# Altium project ANTS-MotherBoard-B1.PrjPcb (part 1 of 2)
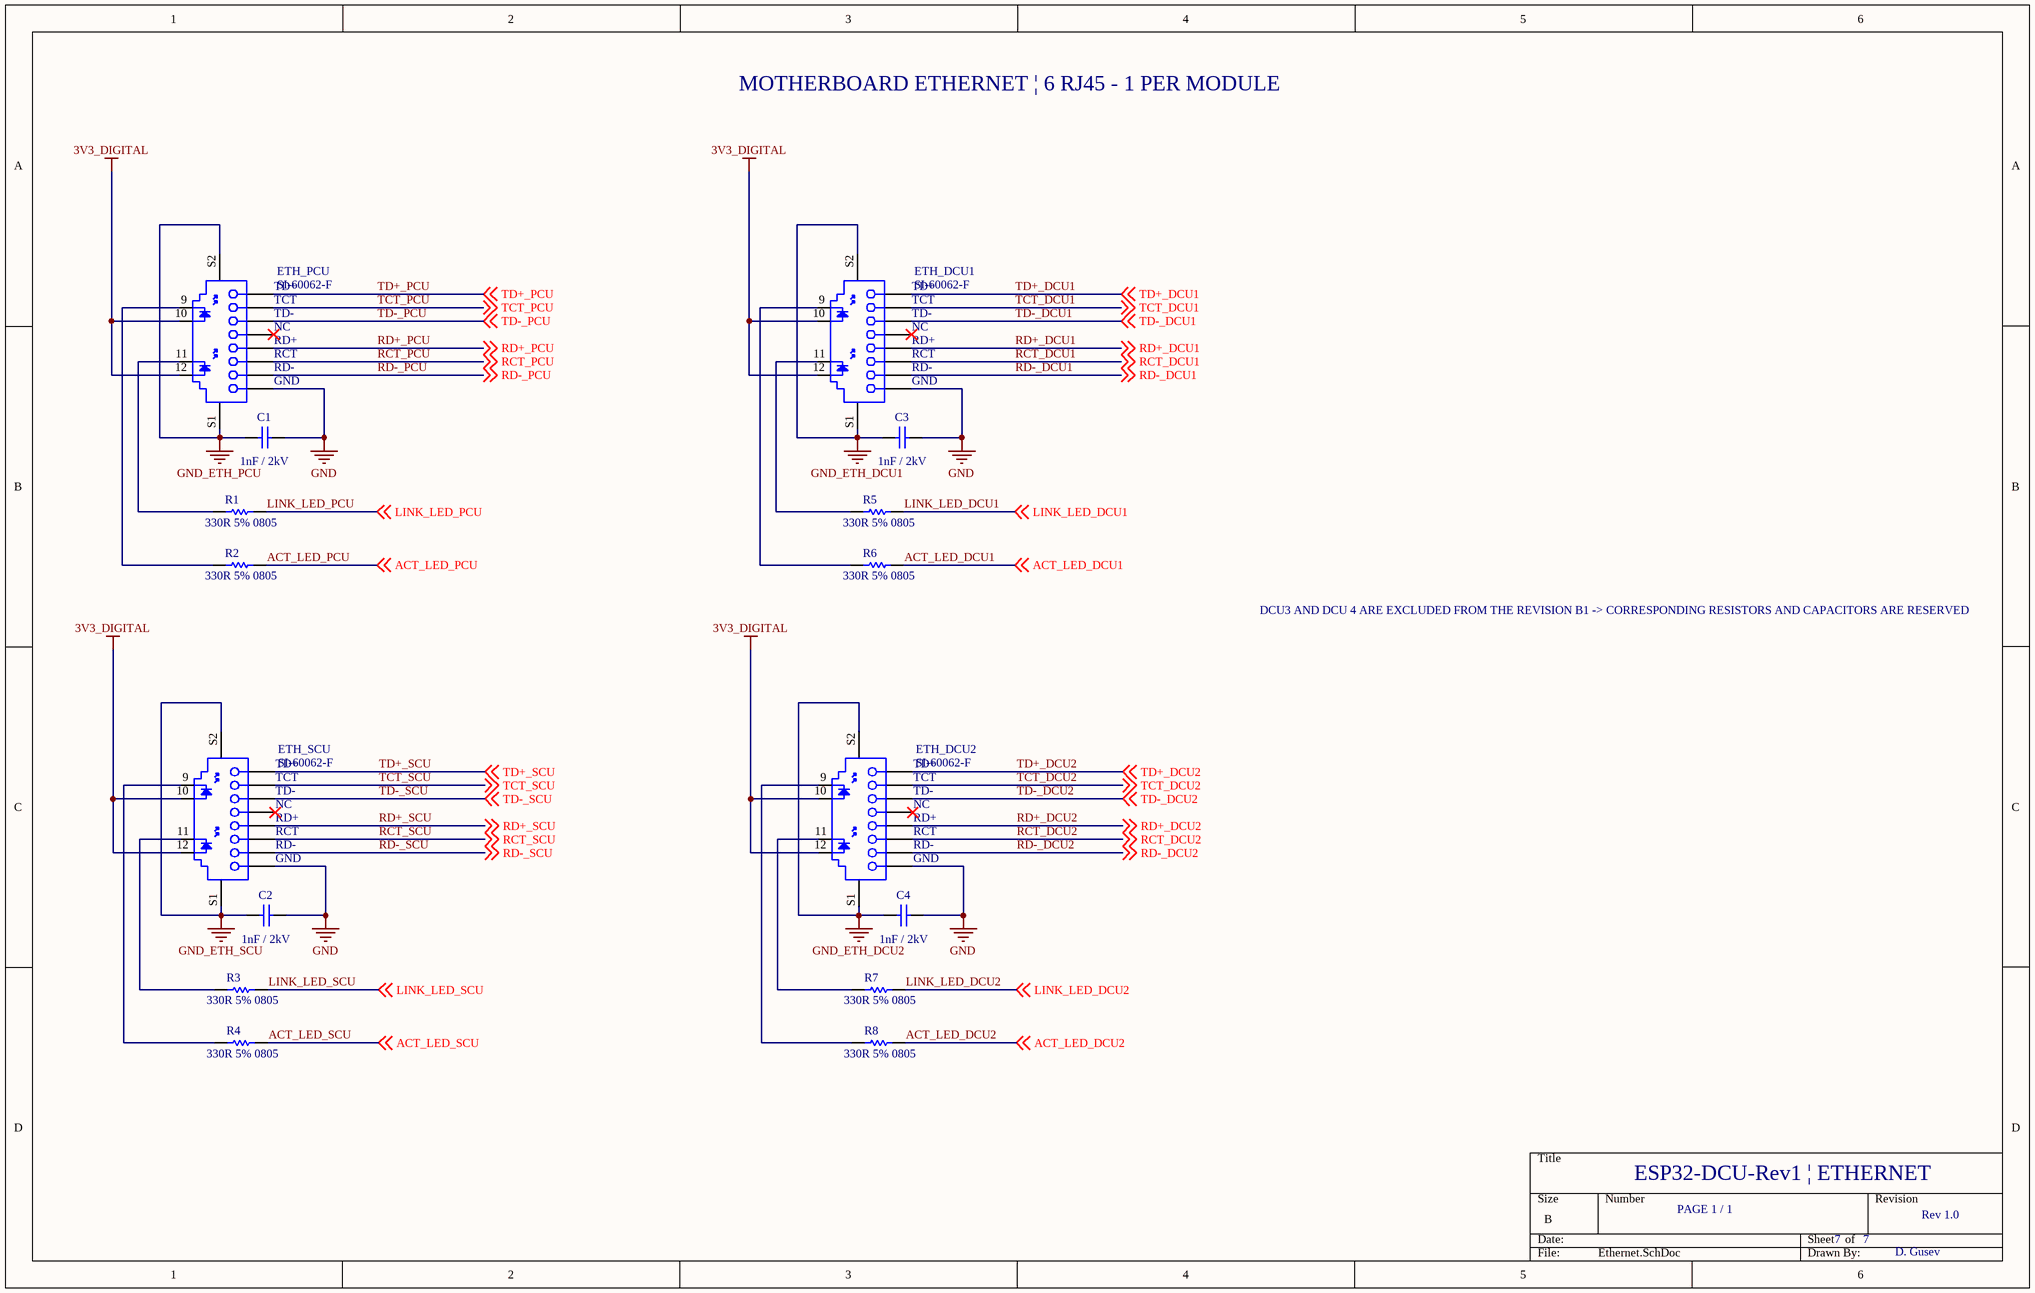
[diagram p0: Ethernet.SchDoc]
10 sheets, 42 parts. Net scope: global (net labels, ports and power ports of the same name join across sheets).
Board file: ANTS-MotherBoard-B1.PcbDoc
Sheets:
  Ethernet.SchDoc
  Motor1_PCIe.SchDoc
  Motor2_PCIe.SchDoc
  Motor3_PCIe.SchDoc
  Motor4_PCIe.SchDoc
  Motor_External_Connectors.SchDoc
  PCU_PCIe.SchDoc
  Power_External_Connectors.SchDoc
  SCU_External_Connectors.SchDoc
  SCU_PCIe.SchDoc

## Sheet Ethernet.SchDoc
size B

### Parts
C1  1nF / 2kV  [CAPC4532X155X60LL30T35]
C2  1nF / 2kV  [CAPC4532X155X60LL30T35]
C3  1nF / 2kV  [CAPC4532X155X60LL30T35]
C4  1nF / 2kV  [CAPC4532X155X60LL30T35]
ETH_DCU1  SI-60062-F  [BELF-SI-60062-F_V]
ETH_DCU2  SI-60062-F  [BELF-SI-60062-F_V]
ETH_PCU  SI-60062-F  [BELF-SI-60062-F_V]
ETH_SCU  SI-60062-F  [BELF-SI-60062-F_V]
R1  330R 5% 0805  [RESC2013X60X35LL10T20]
R2  330R 5% 0805  [RESC2013X60X35LL10T20]
R3  330R 5% 0805  [RESC2013X60X35LL10T20]
R4  330R 5% 0805  [RESC2013X60X35LL10T20]
R5  330R 5% 0805  [RESC2013X60X35LL10T20]
R6  330R 5% 0805  [RESC2013X60X35LL10T20]
R7  330R 5% 0805  [RESC2013X60X35LL10T20]
R8  330R 5% 0805  [RESC2013X60X35LL10T20]

### Nets
3V3_DIGITAL: ETH_DCU1.10 ETH_DCU1.12 ETH_DCU2.10 ETH_DCU2.12 ETH_PCU.10 ETH_PCU.12 ETH_SCU.10 ETH_SCU.12
GND: C1.2 C2.2 C3.2 C4.2 ETH_DCU1.8(GND) ETH_DCU2.8(GND) ETH_PCU.8(GND) ETH_SCU.8(GND)
GND_ETH_DCU1: C3.1 ETH_DCU1.S1 ETH_DCU1.S2
GND_ETH_DCU2: C4.1 ETH_DCU2.S1 ETH_DCU2.S2
GND_ETH_PCU: C1.1 ETH_PCU.S1 ETH_PCU.S2
GND_ETH_SCU: C2.1 ETH_SCU.S1 ETH_SCU.S2
ACT_LED_DCU1: R6.2 ; off-sheet ACT_LED_DCU1
ACT_LED_DCU2: R8.2 ; off-sheet ACT_LED_DCU2
ACT_LED_PCU: R2.2 ; off-sheet ACT_LED_PCU
ACT_LED_SCU: R4.2 ; off-sheet ACT_LED_SCU
LINK_LED_DCU1: R5.2 ; off-sheet LINK_LED_DCU1
LINK_LED_DCU2: R7.2 ; off-sheet LINK_LED_DCU2
LINK_LED_PCU: R1.2 ; off-sheet LINK_LED_PCU
LINK_LED_SCU: R3.2 ; off-sheet LINK_LED_SCU
RCT_DCU1: ETH_DCU1.6(RCT) ; off-sheet RCT_DCU1
RCT_DCU2: ETH_DCU2.6(RCT) ; off-sheet RCT_DCU2
RCT_PCU: ETH_PCU.6(RCT) ; off-sheet RCT_PCU
RCT_SCU: ETH_SCU.6(RCT) ; off-sheet RCT_SCU
RD+_DCU1: ETH_DCU1.5(RD+) ; off-sheet RD+_DCU1
RD+_DCU2: ETH_DCU2.5(RD+) ; off-sheet RD+_DCU2
RD+_PCU: ETH_PCU.5(RD+) ; off-sheet RD+_PCU
RD+_SCU: ETH_SCU.5(RD+) ; off-sheet RD+_SCU
RD-_DCU1: ETH_DCU1.7(RD-) ; off-sheet RD-_DCU1
RD-_DCU2: ETH_DCU2.7(RD-) ; off-sheet RD-_DCU2
RD-_PCU: ETH_PCU.7(RD-) ; off-sheet RD-_PCU
RD-_SCU: ETH_SCU.7(RD-) ; off-sheet RD-_SCU
TCT_DCU1: ETH_DCU1.2(TCT) ; off-sheet TCT_DCU1
TCT_DCU2: ETH_DCU2.2(TCT) ; off-sheet TCT_DCU2
TCT_PCU: ETH_PCU.2(TCT) ; off-sheet TCT_PCU
TCT_SCU: ETH_SCU.2(TCT) ; off-sheet TCT_SCU
TD+_DCU1: ETH_DCU1.1(TD+) ; off-sheet TD+_DCU1
TD+_DCU2: ETH_DCU2.1(TD+) ; off-sheet TD+_DCU2
TD+_PCU: ETH_PCU.1(TD+) ; off-sheet TD+_PCU
TD+_SCU: ETH_SCU.1(TD+) ; off-sheet TD+_SCU
TD-_DCU1: ETH_DCU1.3(TD-) ; off-sheet TD-_DCU1
TD-_DCU2: ETH_DCU2.3(TD-) ; off-sheet TD-_DCU2
TD-_PCU: ETH_PCU.3(TD-) ; off-sheet TD-_PCU
TD-_SCU: ETH_SCU.3(TD-) ; off-sheet TD-_SCU
NetETH_DCU1_9: ETH_DCU1.9 R6.1
NetETH_DCU1_11: ETH_DCU1.11 R5.1
NetETH_DCU2_9: ETH_DCU2.9 R8.1
NetETH_DCU2_11: ETH_DCU2.11 R7.1
NetETH_PCU_9: ETH_PCU.9 R2.1
NetETH_PCU_11: ETH_PCU.11 R1.1
NetETH_SCU_9: ETH_SCU.9 R4.1
NetETH_SCU_11: ETH_SCU.11 R3.1

Not connected (* = marked no-connect by the designer): ETH_DCU1 4(NC)*; ETH_DCU2 4(NC)*; ETH_PCU 4(NC)*; ETH_SCU 4(NC)*

### Notes on the sheet
- MOTHERBOARD ETHERNET | 6 RJ45 - 1 PER MODULE
- DCU3 AND DCU 4 ARE EXCLUDED FROM THE REVISION B1 -> CORRESPONDING RESISTORS AND CAPACITORS ARE RESERVED
- ESP32-DCU-Rev1 | ETHERNET
- PAGE 1 / 1
- 7
- Rev 1.0
- D. Gusev

### Library data of the parts
C1-C4 = CMP-2000-06032-1: Chip Capacitor, 1000 pF, +/- 10%, 2000 V, -55 to 125 degC, 1812 (4532 Metric), RoHS, Tape and Reel; Manufacturer: Kemet; Kits: 399-5086-ND-KITCERHI-VOLTAGECAPS; Catalog Drawings: ACTU_1812; Capacitance: 1000pF; Product Training Modules: CapacitorBasics-TypicalUsesforCapacitors; Online Catalog: X7RDielectricHighVoltage; Other Names: 399-3447-1; Temperature Coefficient: X7R; Voltage - Rated: 2000V(2kV); Family: CeramicCapacitors; Height - Seated (Max): -; Standard Package: 1; Size / Dimension: 0.177"Lx0.126"W(4.50mmx3.20mm); Datasheet URL: http://capacitoredge.kemet.com/capedge2/DataSheet/Datasheet-C1812C102KGRACTU.pdf?pn=C1812C102KGRACTU; Datasheet Version: 09/2016; Thickness (Max): 0.061"(1.55mm); Applications: SMPSFiltering; Package Description: 2-Pin Surface Mount Device, Body 4.5 x 3.2 mm; Package Reference: 1812; Mounting Technology: SurfaceMount; Packaging: CutTape(CT); Manufacturer URL: http://www.kemet.com/; Operating Temperature: -55°C~125°C; Mounting Type: SurfaceMount,MLCC; Features: HighVoltage; Package / Case: 1812(4532Metric); Lead Spacing: -; Tolerance: ±10%; Lead Style: -; Series: C; Category: Capacitors; Ratings: -
ETH_DCU1 ETH_DCU2 ETH_PCU ETH_SCU = CMP-2000-07059-1: 1 Port RJ45 Magjack Connector with Yellow and Green LED, 10/100 Base-T, 12-Pin THD, RoHS, Tray; Manufacturer: Bel Fuse; Number of Ways: 8P4C; Gender: Female; Shield Type: STP; Connector Type: RJ45; Contact Plating: Gold; Mounting Type: ThroughHole; Datasheet Version: Rev. B0, 09/2008; Package Reference: SI-60062-F; Manufacturer URL: http://belfuse.com/; Package Description: 12-Pin Through Hole Device, Body 21.59 x 16.13 mm; Series: MagJack; Contact Material: CopperAlloy; Datasheet URL: http://belfuse.com/pdfs/SI-60062-F.pdf; Width: 17.98mm; Length: 15.21mm; Mounting Technology: ThroughHole; Depth: 21.59mm; Orientation: Straight
R1-R8 = CMP-2000-06960-1: Chip Resistor, 330 Ohm, +/- 1%, 125 mW, -55 to 155 degC, 0805 (2012 Metric), RoHS, Tape and Reel; Manufacturer: Yageo; Voltage Rating: 150V; Temperature Coefficient: 100PPM/C; Power Rating: 125mW(1/8W); Resistance: 330Ohms; Datasheet Version: Rev. 7, 05/2017; Termination Style: SMD/SMT; Case Code - mm: 2012; Package Description: 2-Pin Surface Mounted Device, Body 2 x 1.25 mm; Operating Temperature Range: -55Cto+155C; Case Code - in: 0805; Packaging: Reel; Tolerance: 1%; Package Reference: 0805; Mounting Technology: SurfaceMount; Product: ThickFilmResistorsGeneralPurpose; Series: RC; Manufacturer URL: http://www.yageo.com/; Datasheet URL: http://www.yageo.com/documents/recent/PYu-RC_Group_51_RoHS_L_7.pdf

## Sheet Motor1_PCIe.SchDoc
size B
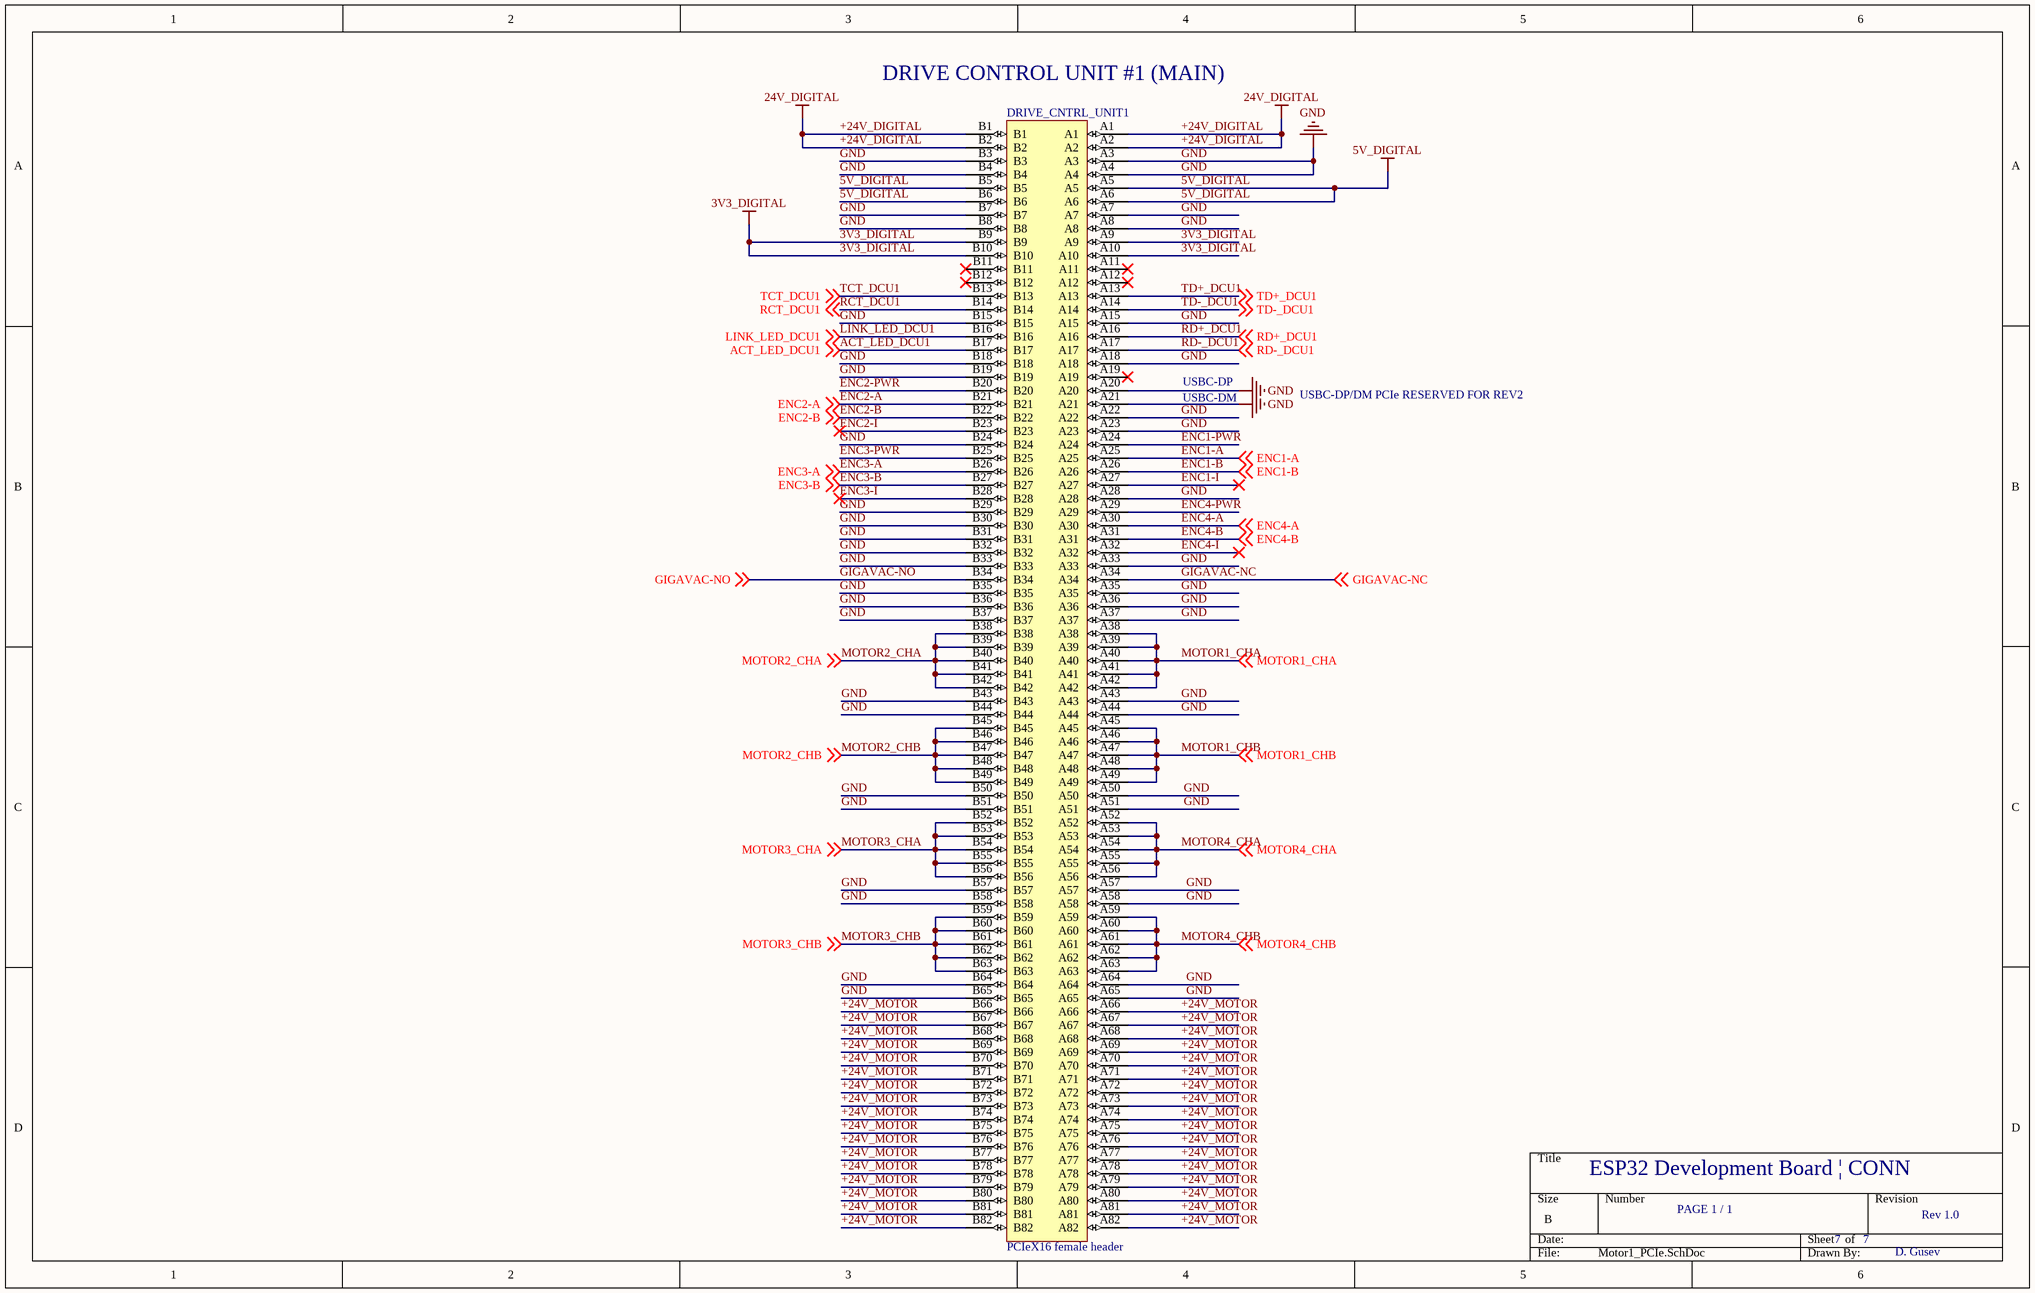
[diagram p1: Motor1_PCIe.SchDoc]

### Parts
DRIVE_CNTRL_UNIT1  PCIeX16 female header  [SAMTEC_PCIE-164-02-X-D-TH]

### Nets
3V3_DIGITAL: DRIVE_CNTRL_UNIT1.A9 DRIVE_CNTRL_UNIT1.A10 DRIVE_CNTRL_UNIT1.B9 DRIVE_CNTRL_UNIT1.B10
5V_DIGITAL: DRIVE_CNTRL_UNIT1.A5 DRIVE_CNTRL_UNIT1.A6 DRIVE_CNTRL_UNIT1.B5 DRIVE_CNTRL_UNIT1.B6
+24V_DIGITAL: DRIVE_CNTRL_UNIT1.A1 DRIVE_CNTRL_UNIT1.A2 DRIVE_CNTRL_UNIT1.B1 DRIVE_CNTRL_UNIT1.B2  [also labelled 24V_DIGITAL]
+24V_MOTOR: DRIVE_CNTRL_UNIT1.A66 DRIVE_CNTRL_UNIT1.A67 DRIVE_CNTRL_UNIT1.A68 DRIVE_CNTRL_UNIT1.A69 DRIVE_CNTRL_UNIT1.A70 DRIVE_CNTRL_UNIT1.A71 DRIVE_CNTRL_UNIT1.A72 DRIVE_CNTRL_UNIT1.A73 DRIVE_CNTRL_UNIT1.A74 DRIVE_CNTRL_UNIT1.A75 DRIVE_CNTRL_UNIT1.A76 DRIVE_CNTRL_UNIT1.A77 DRIVE_CNTRL_UNIT1.A78 DRIVE_CNTRL_UNIT1.A79 DRIVE_CNTRL_UNIT1.A80 DRIVE_CNTRL_UNIT1.A81 DRIVE_CNTRL_UNIT1.A82 DRIVE_CNTRL_UNIT1.B66 DRIVE_CNTRL_UNIT1.B67 DRIVE_CNTRL_UNIT1.B68 DRIVE_CNTRL_UNIT1.B69 DRIVE_CNTRL_UNIT1.B70 DRIVE_CNTRL_UNIT1.B71 DRIVE_CNTRL_UNIT1.B72 DRIVE_CNTRL_UNIT1.B73 DRIVE_CNTRL_UNIT1.B74 DRIVE_CNTRL_UNIT1.B75 DRIVE_CNTRL_UNIT1.B76 DRIVE_CNTRL_UNIT1.B77 DRIVE_CNTRL_UNIT1.B78 DRIVE_CNTRL_UNIT1.B79 DRIVE_CNTRL_UNIT1.B80 DRIVE_CNTRL_UNIT1.B81 DRIVE_CNTRL_UNIT1.B82
GND: DRIVE_CNTRL_UNIT1.A3 DRIVE_CNTRL_UNIT1.A4 DRIVE_CNTRL_UNIT1.A7 DRIVE_CNTRL_UNIT1.A8 DRIVE_CNTRL_UNIT1.A15 DRIVE_CNTRL_UNIT1.A18 DRIVE_CNTRL_UNIT1.A20 DRIVE_CNTRL_UNIT1.A21 DRIVE_CNTRL_UNIT1.A22 DRIVE_CNTRL_UNIT1.A23 DRIVE_CNTRL_UNIT1.A28 DRIVE_CNTRL_UNIT1.A33 DRIVE_CNTRL_UNIT1.A35 DRIVE_CNTRL_UNIT1.A36 DRIVE_CNTRL_UNIT1.A37 DRIVE_CNTRL_UNIT1.A43 DRIVE_CNTRL_UNIT1.A44 DRIVE_CNTRL_UNIT1.A50 DRIVE_CNTRL_UNIT1.A51 DRIVE_CNTRL_UNIT1.A57 DRIVE_CNTRL_UNIT1.A58 DRIVE_CNTRL_UNIT1.A64 DRIVE_CNTRL_UNIT1.A65 DRIVE_CNTRL_UNIT1.B3 DRIVE_CNTRL_UNIT1.B4 DRIVE_CNTRL_UNIT1.B7 DRIVE_CNTRL_UNIT1.B8 DRIVE_CNTRL_UNIT1.B15 DRIVE_CNTRL_UNIT1.B18 DRIVE_CNTRL_UNIT1.B19 DRIVE_CNTRL_UNIT1.B24 DRIVE_CNTRL_UNIT1.B29 DRIVE_CNTRL_UNIT1.B30 DRIVE_CNTRL_UNIT1.B31 DRIVE_CNTRL_UNIT1.B32 DRIVE_CNTRL_UNIT1.B33 DRIVE_CNTRL_UNIT1.B35 DRIVE_CNTRL_UNIT1.B36 DRIVE_CNTRL_UNIT1.B37 DRIVE_CNTRL_UNIT1.B43 DRIVE_CNTRL_UNIT1.B44 DRIVE_CNTRL_UNIT1.B50 DRIVE_CNTRL_UNIT1.B51 DRIVE_CNTRL_UNIT1.B57 DRIVE_CNTRL_UNIT1.B58 DRIVE_CNTRL_UNIT1.B64 DRIVE_CNTRL_UNIT1.B65
ACT_LED_DCU1: DRIVE_CNTRL_UNIT1.B17 ; off-sheet ACT_LED_DCU1
ENC1-A: DRIVE_CNTRL_UNIT1.A25 ; off-sheet ENC1-A
ENC1-B: DRIVE_CNTRL_UNIT1.A26 ; off-sheet ENC1-B
ENC1-I: DRIVE_CNTRL_UNIT1.A27
ENC1-PWR: DRIVE_CNTRL_UNIT1.A24
ENC2-A: DRIVE_CNTRL_UNIT1.B21 ; off-sheet ENC2-A
ENC2-B: DRIVE_CNTRL_UNIT1.B22 ; off-sheet ENC2-B
ENC2-I: DRIVE_CNTRL_UNIT1.B23
ENC2-PWR: DRIVE_CNTRL_UNIT1.B20
ENC3-A: DRIVE_CNTRL_UNIT1.B26 ; off-sheet ENC3-A
ENC3-B: DRIVE_CNTRL_UNIT1.B27 ; off-sheet ENC3-B
ENC3-I: DRIVE_CNTRL_UNIT1.B28
ENC3-PWR: DRIVE_CNTRL_UNIT1.B25
ENC4-A: DRIVE_CNTRL_UNIT1.A30 ; off-sheet ENC4-A
ENC4-B: DRIVE_CNTRL_UNIT1.A31 ; off-sheet ENC4-B
ENC4-I: DRIVE_CNTRL_UNIT1.A32
ENC4-PWR: DRIVE_CNTRL_UNIT1.A29
GIGAVAC-NC: DRIVE_CNTRL_UNIT1.A34 ; off-sheet GIGAVAC-NC
GIGAVAC-NO: DRIVE_CNTRL_UNIT1.B34 ; off-sheet GIGAVAC-NO
LINK_LED_DCU1: DRIVE_CNTRL_UNIT1.B16 ; off-sheet LINK_LED_DCU1
MOTOR1_CHA: DRIVE_CNTRL_UNIT1.A38 DRIVE_CNTRL_UNIT1.A39 DRIVE_CNTRL_UNIT1.A40 DRIVE_CNTRL_UNIT1.A41 DRIVE_CNTRL_UNIT1.A42 ; off-sheet MOTOR1_CHA
MOTOR1_CHB: DRIVE_CNTRL_UNIT1.A45 DRIVE_CNTRL_UNIT1.A46 DRIVE_CNTRL_UNIT1.A47 DRIVE_CNTRL_UNIT1.A48 DRIVE_CNTRL_UNIT1.A49 ; off-sheet MOTOR1_CHB
MOTOR2_CHA: DRIVE_CNTRL_UNIT1.B38 DRIVE_CNTRL_UNIT1.B39 DRIVE_CNTRL_UNIT1.B40 DRIVE_CNTRL_UNIT1.B41 DRIVE_CNTRL_UNIT1.B42 ; off-sheet MOTOR2_CHA
MOTOR2_CHB: DRIVE_CNTRL_UNIT1.B45 DRIVE_CNTRL_UNIT1.B46 DRIVE_CNTRL_UNIT1.B47 DRIVE_CNTRL_UNIT1.B48 DRIVE_CNTRL_UNIT1.B49 ; off-sheet MOTOR2_CHB
MOTOR3_CHA: DRIVE_CNTRL_UNIT1.B52 DRIVE_CNTRL_UNIT1.B53 DRIVE_CNTRL_UNIT1.B54 DRIVE_CNTRL_UNIT1.B55 DRIVE_CNTRL_UNIT1.B56 ; off-sheet MOTOR3_CHA
MOTOR3_CHB: DRIVE_CNTRL_UNIT1.B59 DRIVE_CNTRL_UNIT1.B60 DRIVE_CNTRL_UNIT1.B61 DRIVE_CNTRL_UNIT1.B62 DRIVE_CNTRL_UNIT1.B63 ; off-sheet MOTOR3_CHB
MOTOR4_CHA: DRIVE_CNTRL_UNIT1.A52 DRIVE_CNTRL_UNIT1.A53 DRIVE_CNTRL_UNIT1.A54 DRIVE_CNTRL_UNIT1.A55 DRIVE_CNTRL_UNIT1.A56 ; off-sheet MOTOR4_CHA
MOTOR4_CHB: DRIVE_CNTRL_UNIT1.A59 DRIVE_CNTRL_UNIT1.A60 DRIVE_CNTRL_UNIT1.A61 DRIVE_CNTRL_UNIT1.A62 DRIVE_CNTRL_UNIT1.A63 ; off-sheet MOTOR4_CHB
RCT_DCU1: DRIVE_CNTRL_UNIT1.B14 ; off-sheet RCT_DCU1
RD+_DCU1: DRIVE_CNTRL_UNIT1.A16 ; off-sheet RD+_DCU1
RD-_DCU1: DRIVE_CNTRL_UNIT1.A17 ; off-sheet RD-_DCU1
TCT_DCU1: DRIVE_CNTRL_UNIT1.B13 ; off-sheet TCT_DCU1
TD+_DCU1: DRIVE_CNTRL_UNIT1.A13 ; off-sheet TD+_DCU1
TD-_DCU1: DRIVE_CNTRL_UNIT1.A14 ; off-sheet TD-_DCU1

Not connected (* = marked no-connect by the designer): DRIVE_CNTRL_UNIT1 A11* A12* A19* B11* B12*

### Notes on the sheet
- (near DRIVE_CNTRL_UNIT1) DRIVE CONTROL UNIT #1 (MAIN)
- USBC-DP
- USBC-DM
- USBC-DP/DM PCIe RESERVED FOR REV2
- ESP32 Development Board | CONN
- PAGE 1 / 1
- 7
- Rev 1.0
- D. Gusev

### Library data of the parts
DRIVE_CNTRL_UNIT1 = PCIeX16 female header: 164-position SAMTEC female header

## Sheet Motor2_PCIe.SchDoc
size B
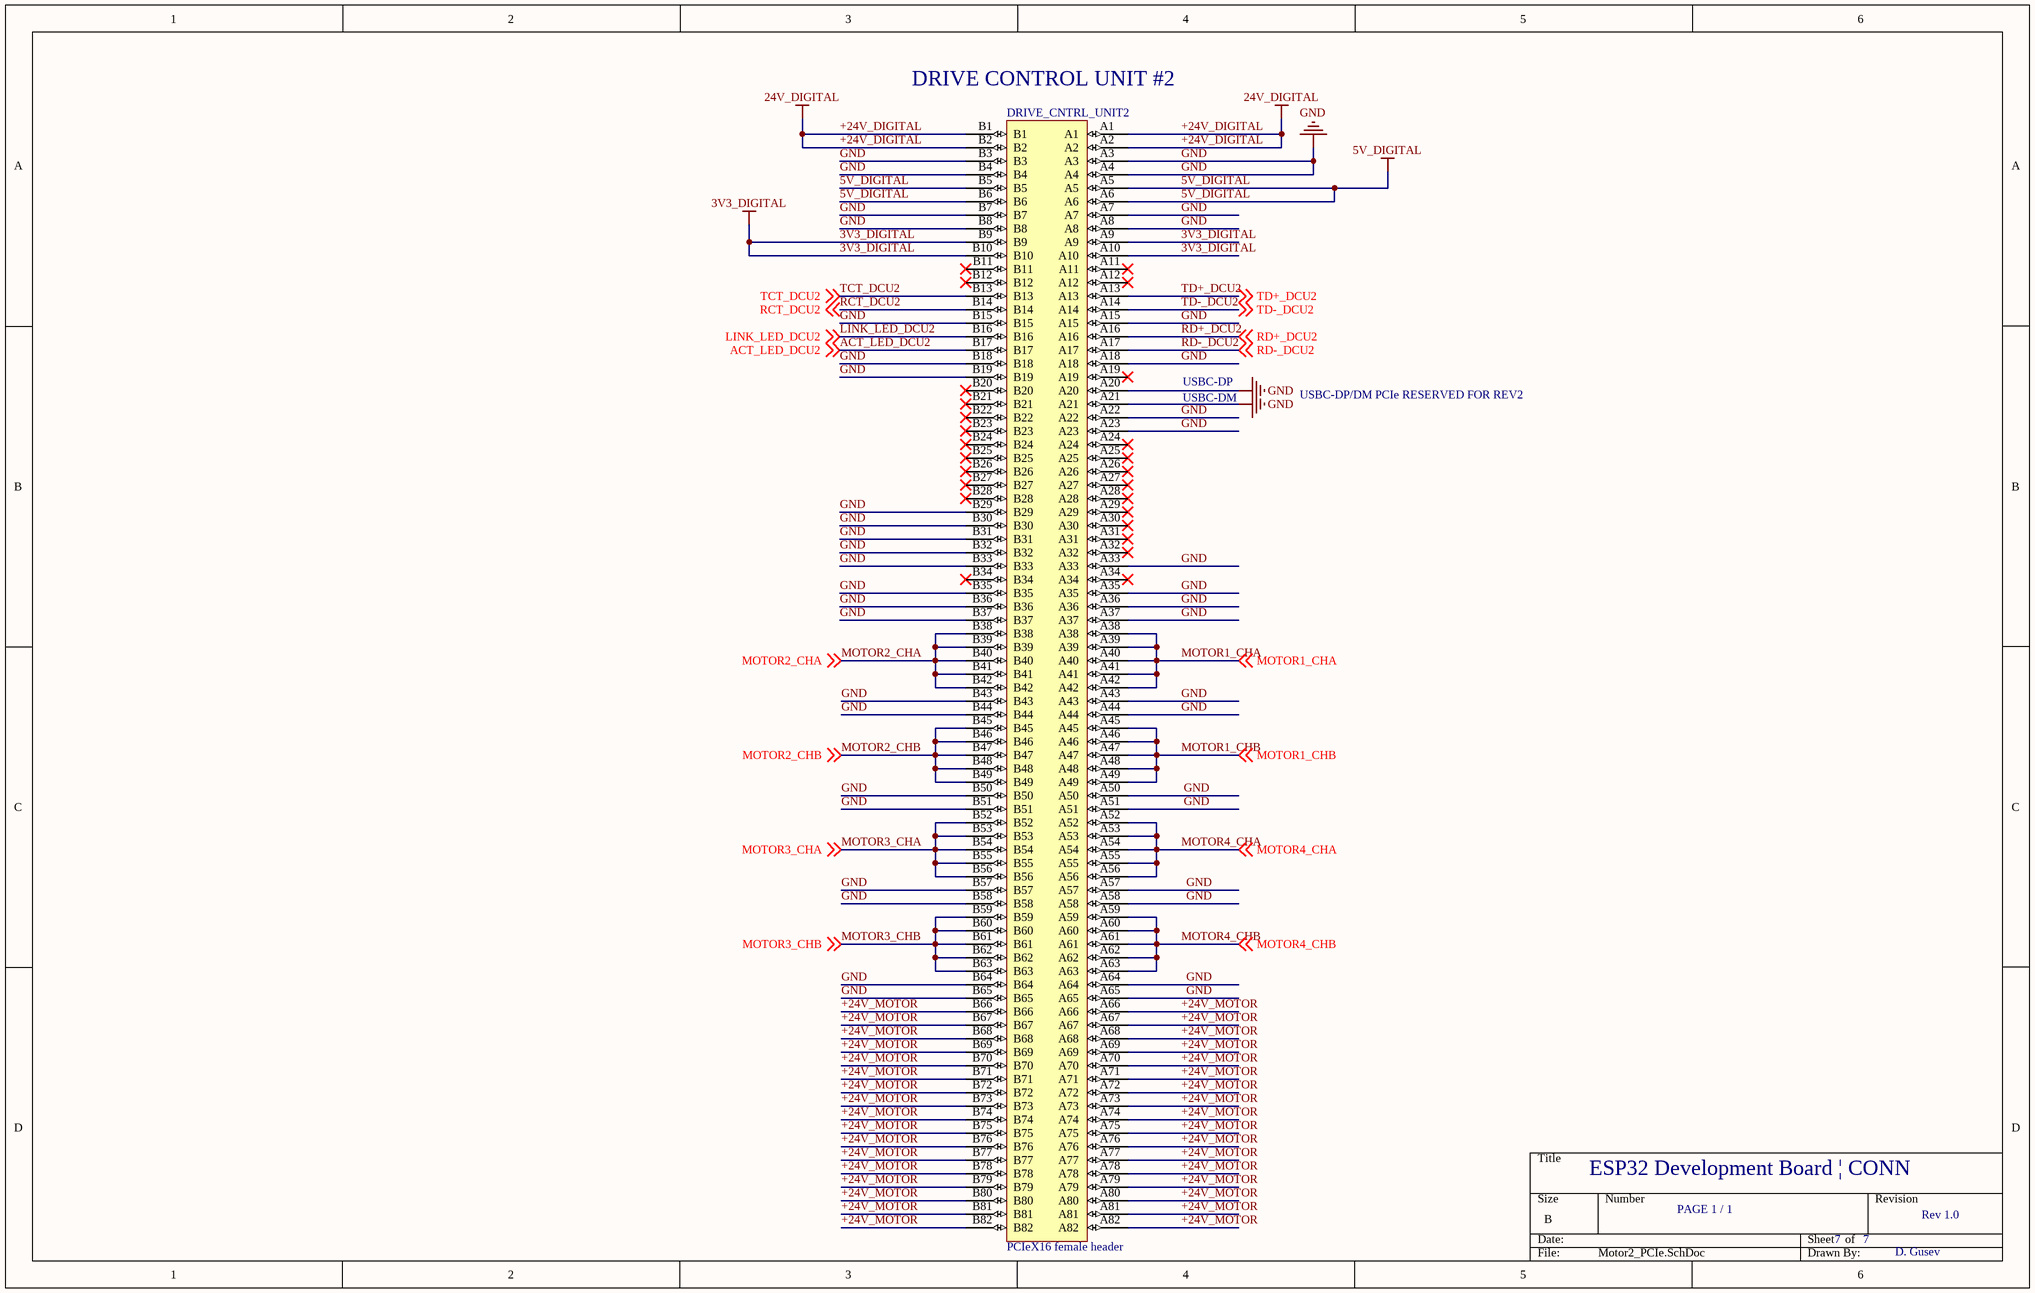
[diagram p2: Motor2_PCIe.SchDoc]

### Parts
DRIVE_CNTRL_UNIT2  PCIeX16 female header  [SAMTEC_PCIE-164-02-X-D-TH]

### Nets
3V3_DIGITAL: DRIVE_CNTRL_UNIT2.A9 DRIVE_CNTRL_UNIT2.A10 DRIVE_CNTRL_UNIT2.B9 DRIVE_CNTRL_UNIT2.B10
5V_DIGITAL: DRIVE_CNTRL_UNIT2.A5 DRIVE_CNTRL_UNIT2.A6 DRIVE_CNTRL_UNIT2.B5 DRIVE_CNTRL_UNIT2.B6
+24V_DIGITAL: DRIVE_CNTRL_UNIT2.A1 DRIVE_CNTRL_UNIT2.A2 DRIVE_CNTRL_UNIT2.B1 DRIVE_CNTRL_UNIT2.B2  [also labelled 24V_DIGITAL]
+24V_MOTOR: DRIVE_CNTRL_UNIT2.A66 DRIVE_CNTRL_UNIT2.A67 DRIVE_CNTRL_UNIT2.A68 DRIVE_CNTRL_UNIT2.A69 DRIVE_CNTRL_UNIT2.A70 DRIVE_CNTRL_UNIT2.A71 DRIVE_CNTRL_UNIT2.A72 DRIVE_CNTRL_UNIT2.A73 DRIVE_CNTRL_UNIT2.A74 DRIVE_CNTRL_UNIT2.A75 DRIVE_CNTRL_UNIT2.A76 DRIVE_CNTRL_UNIT2.A77 DRIVE_CNTRL_UNIT2.A78 DRIVE_CNTRL_UNIT2.A79 DRIVE_CNTRL_UNIT2.A80 DRIVE_CNTRL_UNIT2.A81 DRIVE_CNTRL_UNIT2.A82 DRIVE_CNTRL_UNIT2.B66 DRIVE_CNTRL_UNIT2.B67 DRIVE_CNTRL_UNIT2.B68 DRIVE_CNTRL_UNIT2.B69 DRIVE_CNTRL_UNIT2.B70 DRIVE_CNTRL_UNIT2.B71 DRIVE_CNTRL_UNIT2.B72 DRIVE_CNTRL_UNIT2.B73 DRIVE_CNTRL_UNIT2.B74 DRIVE_CNTRL_UNIT2.B75 DRIVE_CNTRL_UNIT2.B76 DRIVE_CNTRL_UNIT2.B77 DRIVE_CNTRL_UNIT2.B78 DRIVE_CNTRL_UNIT2.B79 DRIVE_CNTRL_UNIT2.B80 DRIVE_CNTRL_UNIT2.B81 DRIVE_CNTRL_UNIT2.B82
GND: DRIVE_CNTRL_UNIT2.A3 DRIVE_CNTRL_UNIT2.A4 DRIVE_CNTRL_UNIT2.A7 DRIVE_CNTRL_UNIT2.A8 DRIVE_CNTRL_UNIT2.A15 DRIVE_CNTRL_UNIT2.A18 DRIVE_CNTRL_UNIT2.A20 DRIVE_CNTRL_UNIT2.A21 DRIVE_CNTRL_UNIT2.A22 DRIVE_CNTRL_UNIT2.A23 DRIVE_CNTRL_UNIT2.A33 DRIVE_CNTRL_UNIT2.A35 DRIVE_CNTRL_UNIT2.A36 DRIVE_CNTRL_UNIT2.A37 DRIVE_CNTRL_UNIT2.A43 DRIVE_CNTRL_UNIT2.A44 DRIVE_CNTRL_UNIT2.A50 DRIVE_CNTRL_UNIT2.A51 DRIVE_CNTRL_UNIT2.A57 DRIVE_CNTRL_UNIT2.A58 DRIVE_CNTRL_UNIT2.A64 DRIVE_CNTRL_UNIT2.A65 DRIVE_CNTRL_UNIT2.B3 DRIVE_CNTRL_UNIT2.B4 DRIVE_CNTRL_UNIT2.B7 DRIVE_CNTRL_UNIT2.B8 DRIVE_CNTRL_UNIT2.B15 DRIVE_CNTRL_UNIT2.B18 DRIVE_CNTRL_UNIT2.B19 DRIVE_CNTRL_UNIT2.B29 DRIVE_CNTRL_UNIT2.B30 DRIVE_CNTRL_UNIT2.B31 DRIVE_CNTRL_UNIT2.B32 DRIVE_CNTRL_UNIT2.B33 DRIVE_CNTRL_UNIT2.B35 DRIVE_CNTRL_UNIT2.B36 DRIVE_CNTRL_UNIT2.B37 DRIVE_CNTRL_UNIT2.B43 DRIVE_CNTRL_UNIT2.B44 DRIVE_CNTRL_UNIT2.B50 DRIVE_CNTRL_UNIT2.B51 DRIVE_CNTRL_UNIT2.B57 DRIVE_CNTRL_UNIT2.B58 DRIVE_CNTRL_UNIT2.B64 DRIVE_CNTRL_UNIT2.B65
ACT_LED_DCU2: DRIVE_CNTRL_UNIT2.B17 ; off-sheet ACT_LED_DCU2
LINK_LED_DCU2: DRIVE_CNTRL_UNIT2.B16 ; off-sheet LINK_LED_DCU2
MOTOR1_CHA: DRIVE_CNTRL_UNIT2.A38 DRIVE_CNTRL_UNIT2.A39 DRIVE_CNTRL_UNIT2.A40 DRIVE_CNTRL_UNIT2.A41 DRIVE_CNTRL_UNIT2.A42 ; off-sheet MOTOR1_CHA
MOTOR1_CHB: DRIVE_CNTRL_UNIT2.A45 DRIVE_CNTRL_UNIT2.A46 DRIVE_CNTRL_UNIT2.A47 DRIVE_CNTRL_UNIT2.A48 DRIVE_CNTRL_UNIT2.A49 ; off-sheet MOTOR1_CHB
MOTOR2_CHA: DRIVE_CNTRL_UNIT2.B38 DRIVE_CNTRL_UNIT2.B39 DRIVE_CNTRL_UNIT2.B40 DRIVE_CNTRL_UNIT2.B41 DRIVE_CNTRL_UNIT2.B42 ; off-sheet MOTOR2_CHA
MOTOR2_CHB: DRIVE_CNTRL_UNIT2.B45 DRIVE_CNTRL_UNIT2.B46 DRIVE_CNTRL_UNIT2.B47 DRIVE_CNTRL_UNIT2.B48 DRIVE_CNTRL_UNIT2.B49 ; off-sheet MOTOR2_CHB
MOTOR3_CHA: DRIVE_CNTRL_UNIT2.B52 DRIVE_CNTRL_UNIT2.B53 DRIVE_CNTRL_UNIT2.B54 DRIVE_CNTRL_UNIT2.B55 DRIVE_CNTRL_UNIT2.B56 ; off-sheet MOTOR3_CHA
MOTOR3_CHB: DRIVE_CNTRL_UNIT2.B59 DRIVE_CNTRL_UNIT2.B60 DRIVE_CNTRL_UNIT2.B61 DRIVE_CNTRL_UNIT2.B62 DRIVE_CNTRL_UNIT2.B63 ; off-sheet MOTOR3_CHB
MOTOR4_CHA: DRIVE_CNTRL_UNIT2.A52 DRIVE_CNTRL_UNIT2.A53 DRIVE_CNTRL_UNIT2.A54 DRIVE_CNTRL_UNIT2.A55 DRIVE_CNTRL_UNIT2.A56 ; off-sheet MOTOR4_CHA
MOTOR4_CHB: DRIVE_CNTRL_UNIT2.A59 DRIVE_CNTRL_UNIT2.A60 DRIVE_CNTRL_UNIT2.A61 DRIVE_CNTRL_UNIT2.A62 DRIVE_CNTRL_UNIT2.A63 ; off-sheet MOTOR4_CHB
RCT_DCU2: DRIVE_CNTRL_UNIT2.B14 ; off-sheet RCT_DCU2
RD+_DCU2: DRIVE_CNTRL_UNIT2.A16 ; off-sheet RD+_DCU2
RD-_DCU2: DRIVE_CNTRL_UNIT2.A17 ; off-sheet RD-_DCU2
TCT_DCU2: DRIVE_CNTRL_UNIT2.B13 ; off-sheet TCT_DCU2
TD+_DCU2: DRIVE_CNTRL_UNIT2.A13 ; off-sheet TD+_DCU2
TD-_DCU2: DRIVE_CNTRL_UNIT2.A14 ; off-sheet TD-_DCU2

Not connected (* = marked no-connect by the designer): DRIVE_CNTRL_UNIT2 A11* A12* A19* A24* A25* A26* A27* A28* A29* A30* A31* A32* A34* B11* B12* B20* B21* B22* B23* B24* B25* B26* B27* B28* B34*

### Notes on the sheet
- (near DRIVE_CNTRL_UNIT2) DRIVE CONTROL UNIT #2
- USBC-DP
- USBC-DM
- USBC-DP/DM PCIe RESERVED FOR REV2
- ESP32 Development Board | CONN
- PAGE 1 / 1
- 7
- Rev 1.0
- D. Gusev

### Library data of the parts
DRIVE_CNTRL_UNIT2 = PCIeX16 female header: 164-position SAMTEC female header

## Sheet Motor3_PCIe.SchDoc
size B
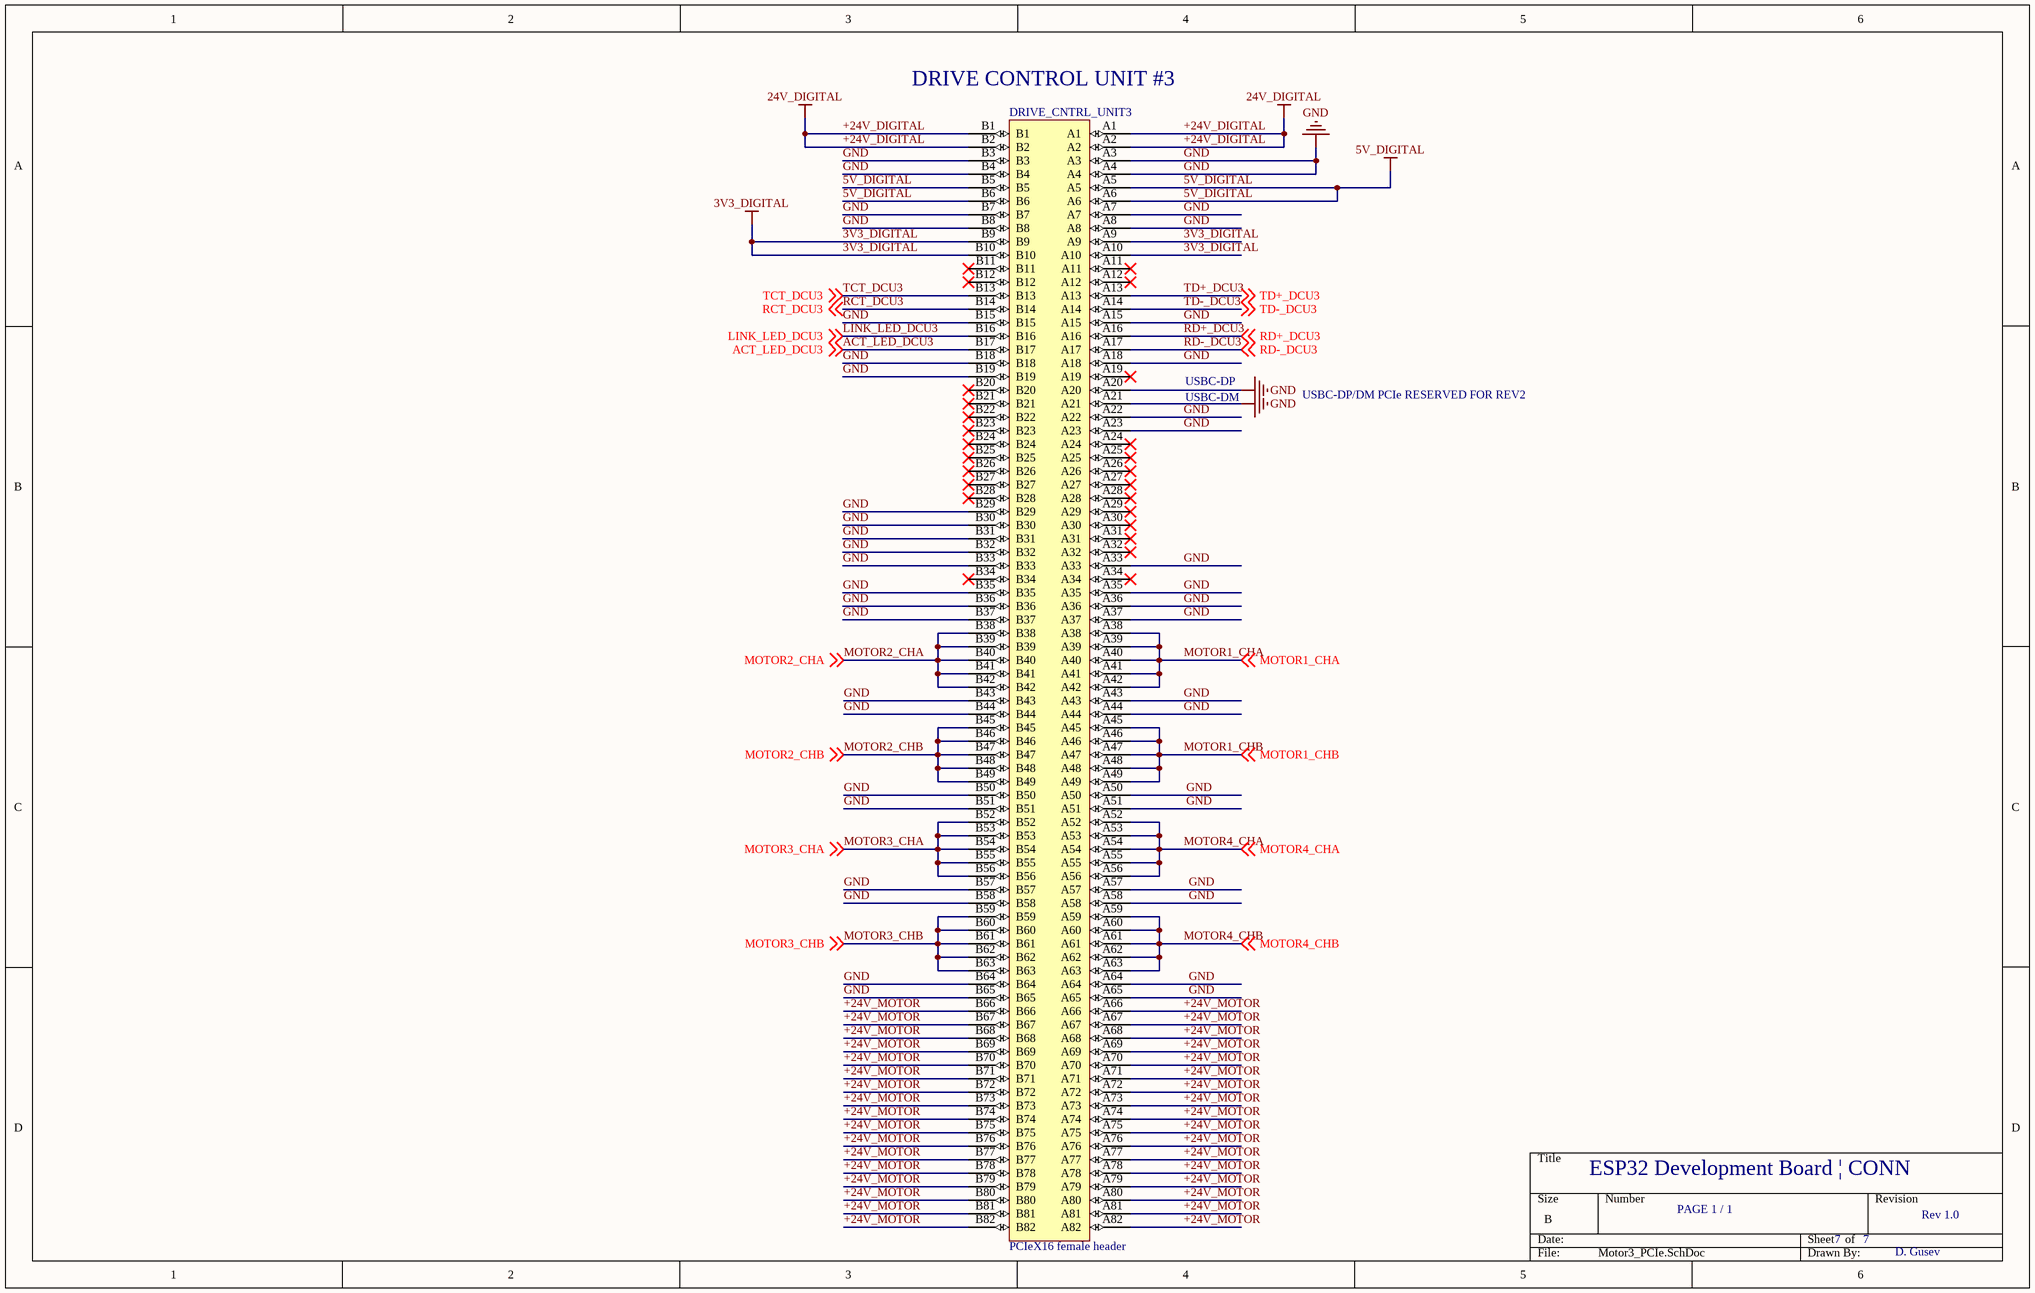
[diagram p3: Motor3_PCIe.SchDoc]

### Parts
DRIVE_CNTRL_UNIT3  PCIeX16 female header  [SAMTEC_PCIE-164-02-X-D-TH]

### Nets
3V3_DIGITAL: DRIVE_CNTRL_UNIT3.A9 DRIVE_CNTRL_UNIT3.A10 DRIVE_CNTRL_UNIT3.B9 DRIVE_CNTRL_UNIT3.B10
5V_DIGITAL: DRIVE_CNTRL_UNIT3.A5 DRIVE_CNTRL_UNIT3.A6 DRIVE_CNTRL_UNIT3.B5 DRIVE_CNTRL_UNIT3.B6
+24V_DIGITAL: DRIVE_CNTRL_UNIT3.A1 DRIVE_CNTRL_UNIT3.A2 DRIVE_CNTRL_UNIT3.B1 DRIVE_CNTRL_UNIT3.B2  [also labelled 24V_DIGITAL]
+24V_MOTOR: DRIVE_CNTRL_UNIT3.A66 DRIVE_CNTRL_UNIT3.A67 DRIVE_CNTRL_UNIT3.A68 DRIVE_CNTRL_UNIT3.A69 DRIVE_CNTRL_UNIT3.A70 DRIVE_CNTRL_UNIT3.A71 DRIVE_CNTRL_UNIT3.A72 DRIVE_CNTRL_UNIT3.A73 DRIVE_CNTRL_UNIT3.A74 DRIVE_CNTRL_UNIT3.A75 DRIVE_CNTRL_UNIT3.A76 DRIVE_CNTRL_UNIT3.A77 DRIVE_CNTRL_UNIT3.A78 DRIVE_CNTRL_UNIT3.A79 DRIVE_CNTRL_UNIT3.A80 DRIVE_CNTRL_UNIT3.A81 DRIVE_CNTRL_UNIT3.A82 DRIVE_CNTRL_UNIT3.B66 DRIVE_CNTRL_UNIT3.B67 DRIVE_CNTRL_UNIT3.B68 DRIVE_CNTRL_UNIT3.B69 DRIVE_CNTRL_UNIT3.B70 DRIVE_CNTRL_UNIT3.B71 DRIVE_CNTRL_UNIT3.B72 DRIVE_CNTRL_UNIT3.B73 DRIVE_CNTRL_UNIT3.B74 DRIVE_CNTRL_UNIT3.B75 DRIVE_CNTRL_UNIT3.B76 DRIVE_CNTRL_UNIT3.B77 DRIVE_CNTRL_UNIT3.B78 DRIVE_CNTRL_UNIT3.B79 DRIVE_CNTRL_UNIT3.B80 DRIVE_CNTRL_UNIT3.B81 DRIVE_CNTRL_UNIT3.B82
GND: DRIVE_CNTRL_UNIT3.A3 DRIVE_CNTRL_UNIT3.A4 DRIVE_CNTRL_UNIT3.A7 DRIVE_CNTRL_UNIT3.A8 DRIVE_CNTRL_UNIT3.A15 DRIVE_CNTRL_UNIT3.A18 DRIVE_CNTRL_UNIT3.A20 DRIVE_CNTRL_UNIT3.A21 DRIVE_CNTRL_UNIT3.A22 DRIVE_CNTRL_UNIT3.A23 DRIVE_CNTRL_UNIT3.A33 DRIVE_CNTRL_UNIT3.A35 DRIVE_CNTRL_UNIT3.A36 DRIVE_CNTRL_UNIT3.A37 DRIVE_CNTRL_UNIT3.A43 DRIVE_CNTRL_UNIT3.A44 DRIVE_CNTRL_UNIT3.A50 DRIVE_CNTRL_UNIT3.A51 DRIVE_CNTRL_UNIT3.A57 DRIVE_CNTRL_UNIT3.A58 DRIVE_CNTRL_UNIT3.A64 DRIVE_CNTRL_UNIT3.A65 DRIVE_CNTRL_UNIT3.B3 DRIVE_CNTRL_UNIT3.B4 DRIVE_CNTRL_UNIT3.B7 DRIVE_CNTRL_UNIT3.B8 DRIVE_CNTRL_UNIT3.B15 DRIVE_CNTRL_UNIT3.B18 DRIVE_CNTRL_UNIT3.B19 DRIVE_CNTRL_UNIT3.B29 DRIVE_CNTRL_UNIT3.B30 DRIVE_CNTRL_UNIT3.B31 DRIVE_CNTRL_UNIT3.B32 DRIVE_CNTRL_UNIT3.B33 DRIVE_CNTRL_UNIT3.B35 DRIVE_CNTRL_UNIT3.B36 DRIVE_CNTRL_UNIT3.B37 DRIVE_CNTRL_UNIT3.B43 DRIVE_CNTRL_UNIT3.B44 DRIVE_CNTRL_UNIT3.B50 DRIVE_CNTRL_UNIT3.B51 DRIVE_CNTRL_UNIT3.B57 DRIVE_CNTRL_UNIT3.B58 DRIVE_CNTRL_UNIT3.B64 DRIVE_CNTRL_UNIT3.B65
ACT_LED_DCU3: DRIVE_CNTRL_UNIT3.B17 ; off-sheet ACT_LED_DCU3
LINK_LED_DCU3: DRIVE_CNTRL_UNIT3.B16 ; off-sheet LINK_LED_DCU3
MOTOR1_CHA: DRIVE_CNTRL_UNIT3.A38 DRIVE_CNTRL_UNIT3.A39 DRIVE_CNTRL_UNIT3.A40 DRIVE_CNTRL_UNIT3.A41 DRIVE_CNTRL_UNIT3.A42 ; off-sheet MOTOR1_CHA
MOTOR1_CHB: DRIVE_CNTRL_UNIT3.A45 DRIVE_CNTRL_UNIT3.A46 DRIVE_CNTRL_UNIT3.A47 DRIVE_CNTRL_UNIT3.A48 DRIVE_CNTRL_UNIT3.A49 ; off-sheet MOTOR1_CHB
MOTOR2_CHA: DRIVE_CNTRL_UNIT3.B38 DRIVE_CNTRL_UNIT3.B39 DRIVE_CNTRL_UNIT3.B40 DRIVE_CNTRL_UNIT3.B41 DRIVE_CNTRL_UNIT3.B42 ; off-sheet MOTOR2_CHA
MOTOR2_CHB: DRIVE_CNTRL_UNIT3.B45 DRIVE_CNTRL_UNIT3.B46 DRIVE_CNTRL_UNIT3.B47 DRIVE_CNTRL_UNIT3.B48 DRIVE_CNTRL_UNIT3.B49 ; off-sheet MOTOR2_CHB
MOTOR3_CHA: DRIVE_CNTRL_UNIT3.B52 DRIVE_CNTRL_UNIT3.B53 DRIVE_CNTRL_UNIT3.B54 DRIVE_CNTRL_UNIT3.B55 DRIVE_CNTRL_UNIT3.B56 ; off-sheet MOTOR3_CHA
MOTOR3_CHB: DRIVE_CNTRL_UNIT3.B59 DRIVE_CNTRL_UNIT3.B60 DRIVE_CNTRL_UNIT3.B61 DRIVE_CNTRL_UNIT3.B62 DRIVE_CNTRL_UNIT3.B63 ; off-sheet MOTOR3_CHB
MOTOR4_CHA: DRIVE_CNTRL_UNIT3.A52 DRIVE_CNTRL_UNIT3.A53 DRIVE_CNTRL_UNIT3.A54 DRIVE_CNTRL_UNIT3.A55 DRIVE_CNTRL_UNIT3.A56 ; off-sheet MOTOR4_CHA
MOTOR4_CHB: DRIVE_CNTRL_UNIT3.A59 DRIVE_CNTRL_UNIT3.A60 DRIVE_CNTRL_UNIT3.A61 DRIVE_CNTRL_UNIT3.A62 DRIVE_CNTRL_UNIT3.A63 ; off-sheet MOTOR4_CHB
RCT_DCU3: DRIVE_CNTRL_UNIT3.B14 ; off-sheet RCT_DCU3
RD+_DCU3: DRIVE_CNTRL_UNIT3.A16 ; off-sheet RD+_DCU3
RD-_DCU3: DRIVE_CNTRL_UNIT3.A17 ; off-sheet RD-_DCU3
TCT_DCU3: DRIVE_CNTRL_UNIT3.B13 ; off-sheet TCT_DCU3
TD+_DCU3: DRIVE_CNTRL_UNIT3.A13 ; off-sheet TD+_DCU3
TD-_DCU3: DRIVE_CNTRL_UNIT3.A14 ; off-sheet TD-_DCU3

Not connected (* = marked no-connect by the designer): DRIVE_CNTRL_UNIT3 A11* A12* A19* A24* A25* A26* A27* A28* A29* A30* A31* A32* A34* B11* B12* B20* B21* B22* B23* B24* B25* B26* B27* B28* B34*

### Notes on the sheet
- (near DRIVE_CNTRL_UNIT3) DRIVE CONTROL UNIT #3
- USBC-DP
- USBC-DM
- USBC-DP/DM PCIe RESERVED FOR REV2
- ESP32 Development Board | CONN
- PAGE 1 / 1
- 7
- Rev 1.0
- D. Gusev

### Library data of the parts
DRIVE_CNTRL_UNIT3 = PCIeX16 female header: 164-position SAMTEC female header

## Sheet Motor4_PCIe.SchDoc
size B
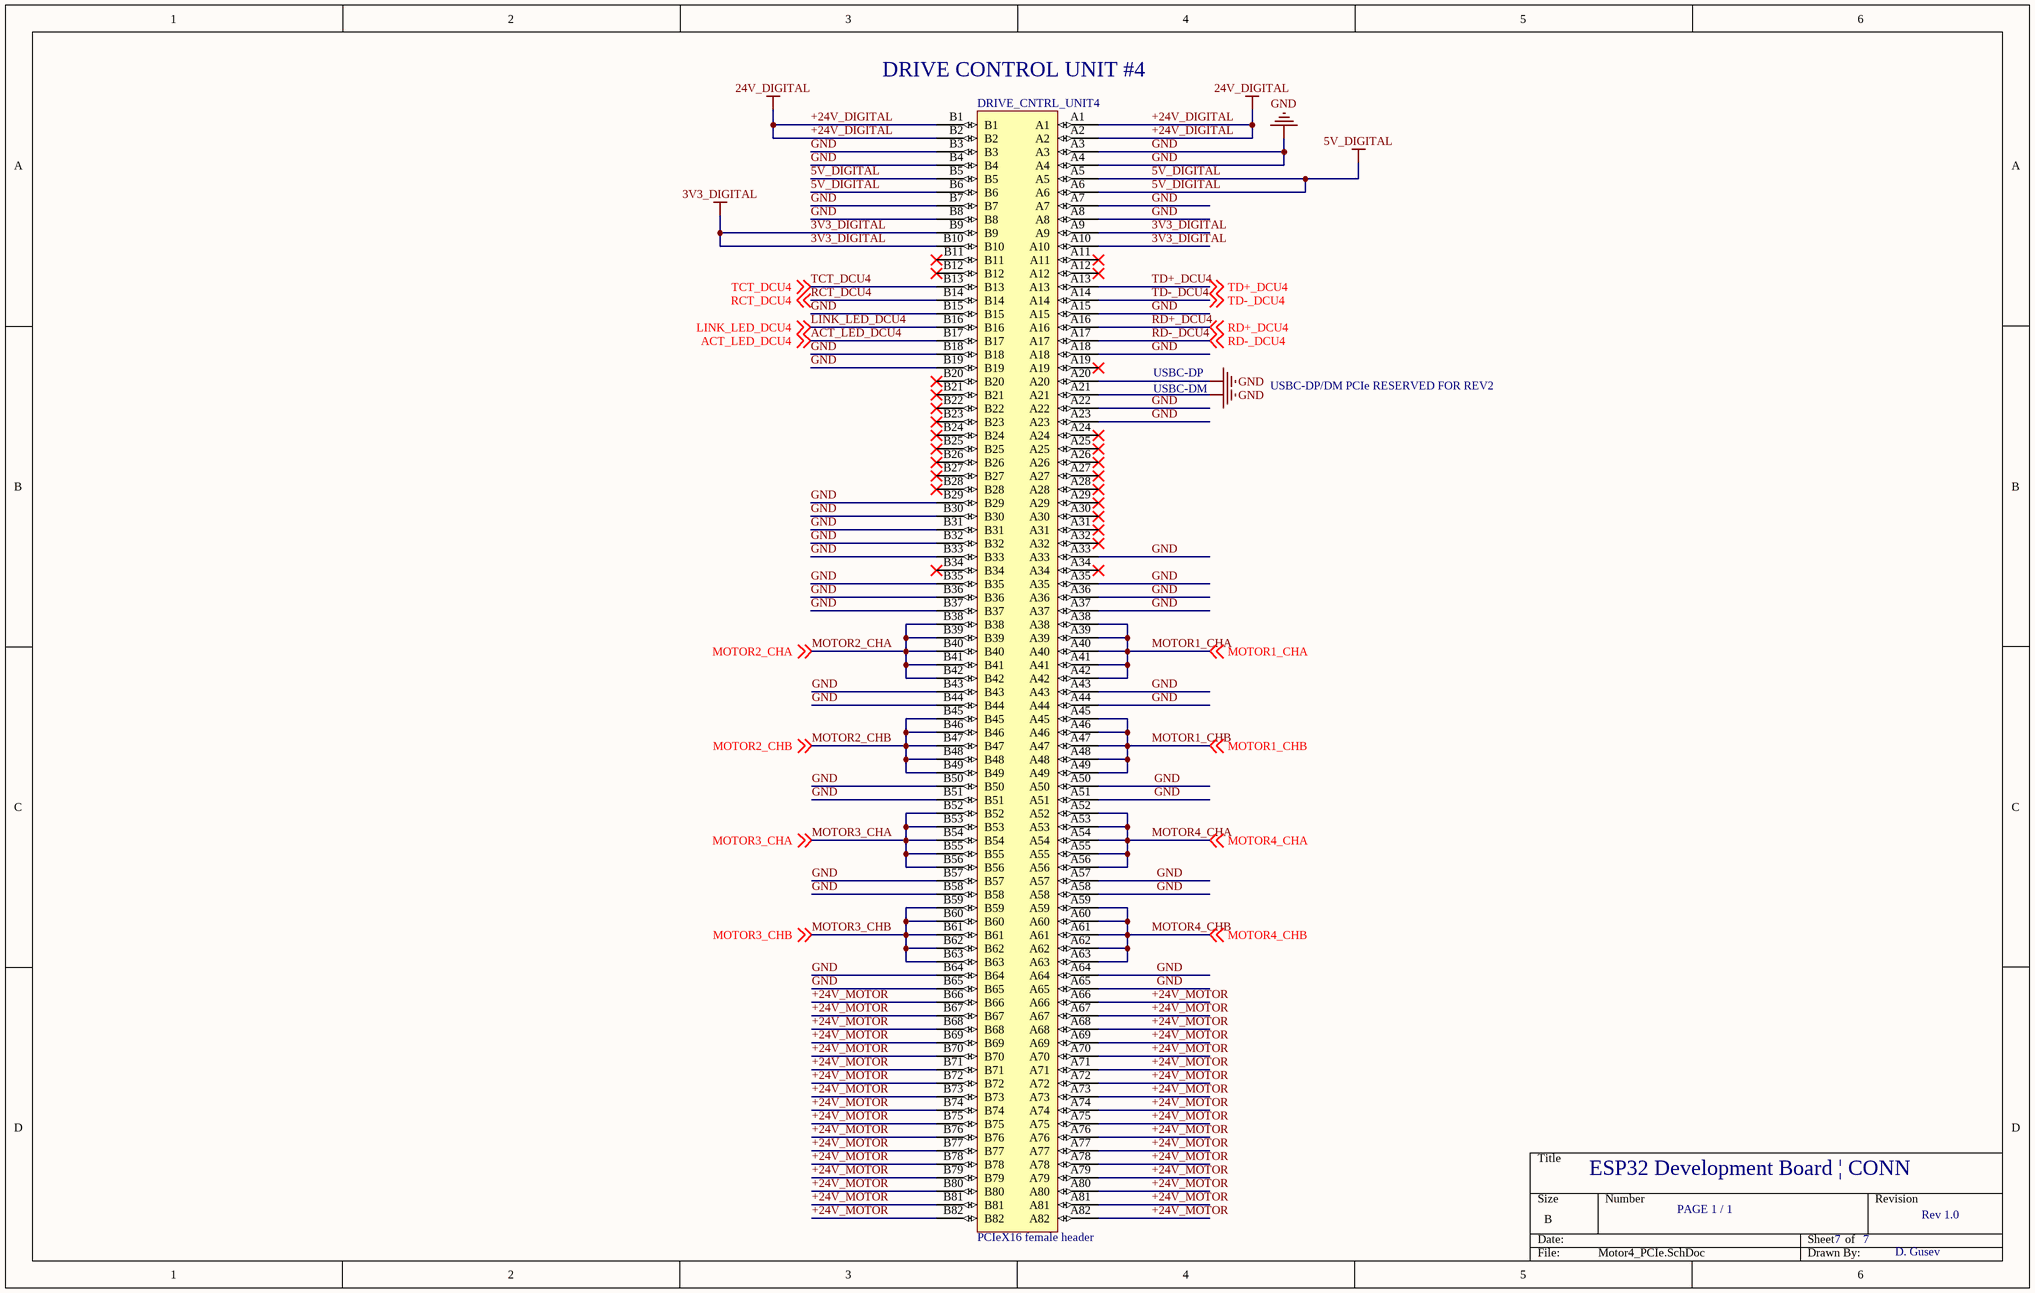
[diagram p4: Motor4_PCIe.SchDoc]

### Parts
DRIVE_CNTRL_UNIT4  PCIeX16 female header  [SAMTEC_PCIE-164-02-X-D-TH]

### Nets
3V3_DIGITAL: DRIVE_CNTRL_UNIT4.A9 DRIVE_CNTRL_UNIT4.A10 DRIVE_CNTRL_UNIT4.B9 DRIVE_CNTRL_UNIT4.B10
5V_DIGITAL: DRIVE_CNTRL_UNIT4.A5 DRIVE_CNTRL_UNIT4.A6 DRIVE_CNTRL_UNIT4.B5 DRIVE_CNTRL_UNIT4.B6
+24V_DIGITAL: DRIVE_CNTRL_UNIT4.A1 DRIVE_CNTRL_UNIT4.A2 DRIVE_CNTRL_UNIT4.B1 DRIVE_CNTRL_UNIT4.B2  [also labelled 24V_DIGITAL]
+24V_MOTOR: DRIVE_CNTRL_UNIT4.A66 DRIVE_CNTRL_UNIT4.A67 DRIVE_CNTRL_UNIT4.A68 DRIVE_CNTRL_UNIT4.A69 DRIVE_CNTRL_UNIT4.A70 DRIVE_CNTRL_UNIT4.A71 DRIVE_CNTRL_UNIT4.A72 DRIVE_CNTRL_UNIT4.A73 DRIVE_CNTRL_UNIT4.A74 DRIVE_CNTRL_UNIT4.A75 DRIVE_CNTRL_UNIT4.A76 DRIVE_CNTRL_UNIT4.A77 DRIVE_CNTRL_UNIT4.A78 DRIVE_CNTRL_UNIT4.A79 DRIVE_CNTRL_UNIT4.A80 DRIVE_CNTRL_UNIT4.A81 DRIVE_CNTRL_UNIT4.A82 DRIVE_CNTRL_UNIT4.B66 DRIVE_CNTRL_UNIT4.B67 DRIVE_CNTRL_UNIT4.B68 DRIVE_CNTRL_UNIT4.B69 DRIVE_CNTRL_UNIT4.B70 DRIVE_CNTRL_UNIT4.B71 DRIVE_CNTRL_UNIT4.B72 DRIVE_CNTRL_UNIT4.B73 DRIVE_CNTRL_UNIT4.B74 DRIVE_CNTRL_UNIT4.B75 DRIVE_CNTRL_UNIT4.B76 DRIVE_CNTRL_UNIT4.B77 DRIVE_CNTRL_UNIT4.B78 DRIVE_CNTRL_UNIT4.B79 DRIVE_CNTRL_UNIT4.B80 DRIVE_CNTRL_UNIT4.B81 DRIVE_CNTRL_UNIT4.B82
GND: DRIVE_CNTRL_UNIT4.A3 DRIVE_CNTRL_UNIT4.A4 DRIVE_CNTRL_UNIT4.A7 DRIVE_CNTRL_UNIT4.A8 DRIVE_CNTRL_UNIT4.A15 DRIVE_CNTRL_UNIT4.A18 DRIVE_CNTRL_UNIT4.A20 DRIVE_CNTRL_UNIT4.A21 DRIVE_CNTRL_UNIT4.A22 DRIVE_CNTRL_UNIT4.A23 DRIVE_CNTRL_UNIT4.A33 DRIVE_CNTRL_UNIT4.A35 DRIVE_CNTRL_UNIT4.A36 DRIVE_CNTRL_UNIT4.A37 DRIVE_CNTRL_UNIT4.A43 DRIVE_CNTRL_UNIT4.A44 DRIVE_CNTRL_UNIT4.A50 DRIVE_CNTRL_UNIT4.A51 DRIVE_CNTRL_UNIT4.A57 DRIVE_CNTRL_UNIT4.A58 DRIVE_CNTRL_UNIT4.A64 DRIVE_CNTRL_UNIT4.A65 DRIVE_CNTRL_UNIT4.B3 DRIVE_CNTRL_UNIT4.B4 DRIVE_CNTRL_UNIT4.B7 DRIVE_CNTRL_UNIT4.B8 DRIVE_CNTRL_UNIT4.B15 DRIVE_CNTRL_UNIT4.B18 DRIVE_CNTRL_UNIT4.B19 DRIVE_CNTRL_UNIT4.B29 DRIVE_CNTRL_UNIT4.B30 DRIVE_CNTRL_UNIT4.B31 DRIVE_CNTRL_UNIT4.B32 DRIVE_CNTRL_UNIT4.B33 DRIVE_CNTRL_UNIT4.B35 DRIVE_CNTRL_UNIT4.B36 DRIVE_CNTRL_UNIT4.B37 DRIVE_CNTRL_UNIT4.B43 DRIVE_CNTRL_UNIT4.B44 DRIVE_CNTRL_UNIT4.B50 DRIVE_CNTRL_UNIT4.B51 DRIVE_CNTRL_UNIT4.B57 DRIVE_CNTRL_UNIT4.B58 DRIVE_CNTRL_UNIT4.B64 DRIVE_CNTRL_UNIT4.B65
ACT_LED_DCU4: DRIVE_CNTRL_UNIT4.B17 ; off-sheet ACT_LED_DCU4
LINK_LED_DCU4: DRIVE_CNTRL_UNIT4.B16 ; off-sheet LINK_LED_DCU4
MOTOR1_CHA: DRIVE_CNTRL_UNIT4.A38 DRIVE_CNTRL_UNIT4.A39 DRIVE_CNTRL_UNIT4.A40 DRIVE_CNTRL_UNIT4.A41 DRIVE_CNTRL_UNIT4.A42 ; off-sheet MOTOR1_CHA
MOTOR1_CHB: DRIVE_CNTRL_UNIT4.A45 DRIVE_CNTRL_UNIT4.A46 DRIVE_CNTRL_UNIT4.A47 DRIVE_CNTRL_UNIT4.A48 DRIVE_CNTRL_UNIT4.A49 ; off-sheet MOTOR1_CHB
MOTOR2_CHA: DRIVE_CNTRL_UNIT4.B38 DRIVE_CNTRL_UNIT4.B39 DRIVE_CNTRL_UNIT4.B40 DRIVE_CNTRL_UNIT4.B41 DRIVE_CNTRL_UNIT4.B42 ; off-sheet MOTOR2_CHA
MOTOR2_CHB: DRIVE_CNTRL_UNIT4.B45 DRIVE_CNTRL_UNIT4.B46 DRIVE_CNTRL_UNIT4.B47 DRIVE_CNTRL_UNIT4.B48 DRIVE_CNTRL_UNIT4.B49 ; off-sheet MOTOR2_CHB
MOTOR3_CHA: DRIVE_CNTRL_UNIT4.B52 DRIVE_CNTRL_UNIT4.B53 DRIVE_CNTRL_UNIT4.B54 DRIVE_CNTRL_UNIT4.B55 DRIVE_CNTRL_UNIT4.B56 ; off-sheet MOTOR3_CHA
MOTOR3_CHB: DRIVE_CNTRL_UNIT4.B59 DRIVE_CNTRL_UNIT4.B60 DRIVE_CNTRL_UNIT4.B61 DRIVE_CNTRL_UNIT4.B62 DRIVE_CNTRL_UNIT4.B63 ; off-sheet MOTOR3_CHB
MOTOR4_CHA: DRIVE_CNTRL_UNIT4.A52 DRIVE_CNTRL_UNIT4.A53 DRIVE_CNTRL_UNIT4.A54 DRIVE_CNTRL_UNIT4.A55 DRIVE_CNTRL_UNIT4.A56 ; off-sheet MOTOR4_CHA
MOTOR4_CHB: DRIVE_CNTRL_UNIT4.A59 DRIVE_CNTRL_UNIT4.A60 DRIVE_CNTRL_UNIT4.A61 DRIVE_CNTRL_UNIT4.A62 DRIVE_CNTRL_UNIT4.A63 ; off-sheet MOTOR4_CHB
RCT_DCU4: DRIVE_CNTRL_UNIT4.B14 ; off-sheet RCT_DCU4
RD+_DCU4: DRIVE_CNTRL_UNIT4.A16 ; off-sheet RD+_DCU4
RD-_DCU4: DRIVE_CNTRL_UNIT4.A17 ; off-sheet RD-_DCU4
TCT_DCU4: DRIVE_CNTRL_UNIT4.B13 ; off-sheet TCT_DCU4
TD+_DCU4: DRIVE_CNTRL_UNIT4.A13 ; off-sheet TD+_DCU4
TD-_DCU4: DRIVE_CNTRL_UNIT4.A14 ; off-sheet TD-_DCU4

Not connected (* = marked no-connect by the designer): DRIVE_CNTRL_UNIT4 A11* A12* A19* A24* A25* A26* A27* A28* A29* A30* A31* A32* A34* B11* B12* B20* B21* B22* B23* B24* B25* B26* B27* B28* B34*

### Notes on the sheet
- (near DRIVE_CNTRL_UNIT4) DRIVE CONTROL UNIT #4
- USBC-DP
- USBC-DM
- USBC-DP/DM PCIe RESERVED FOR REV2
- ESP32 Development Board | CONN
- PAGE 1 / 1
- 7
- Rev 1.0
- D. Gusev

### Library data of the parts
DRIVE_CNTRL_UNIT4 = PCIeX16 female header: 164-position SAMTEC female header

## Sheet Motor_External_Connectors.SchDoc
size B
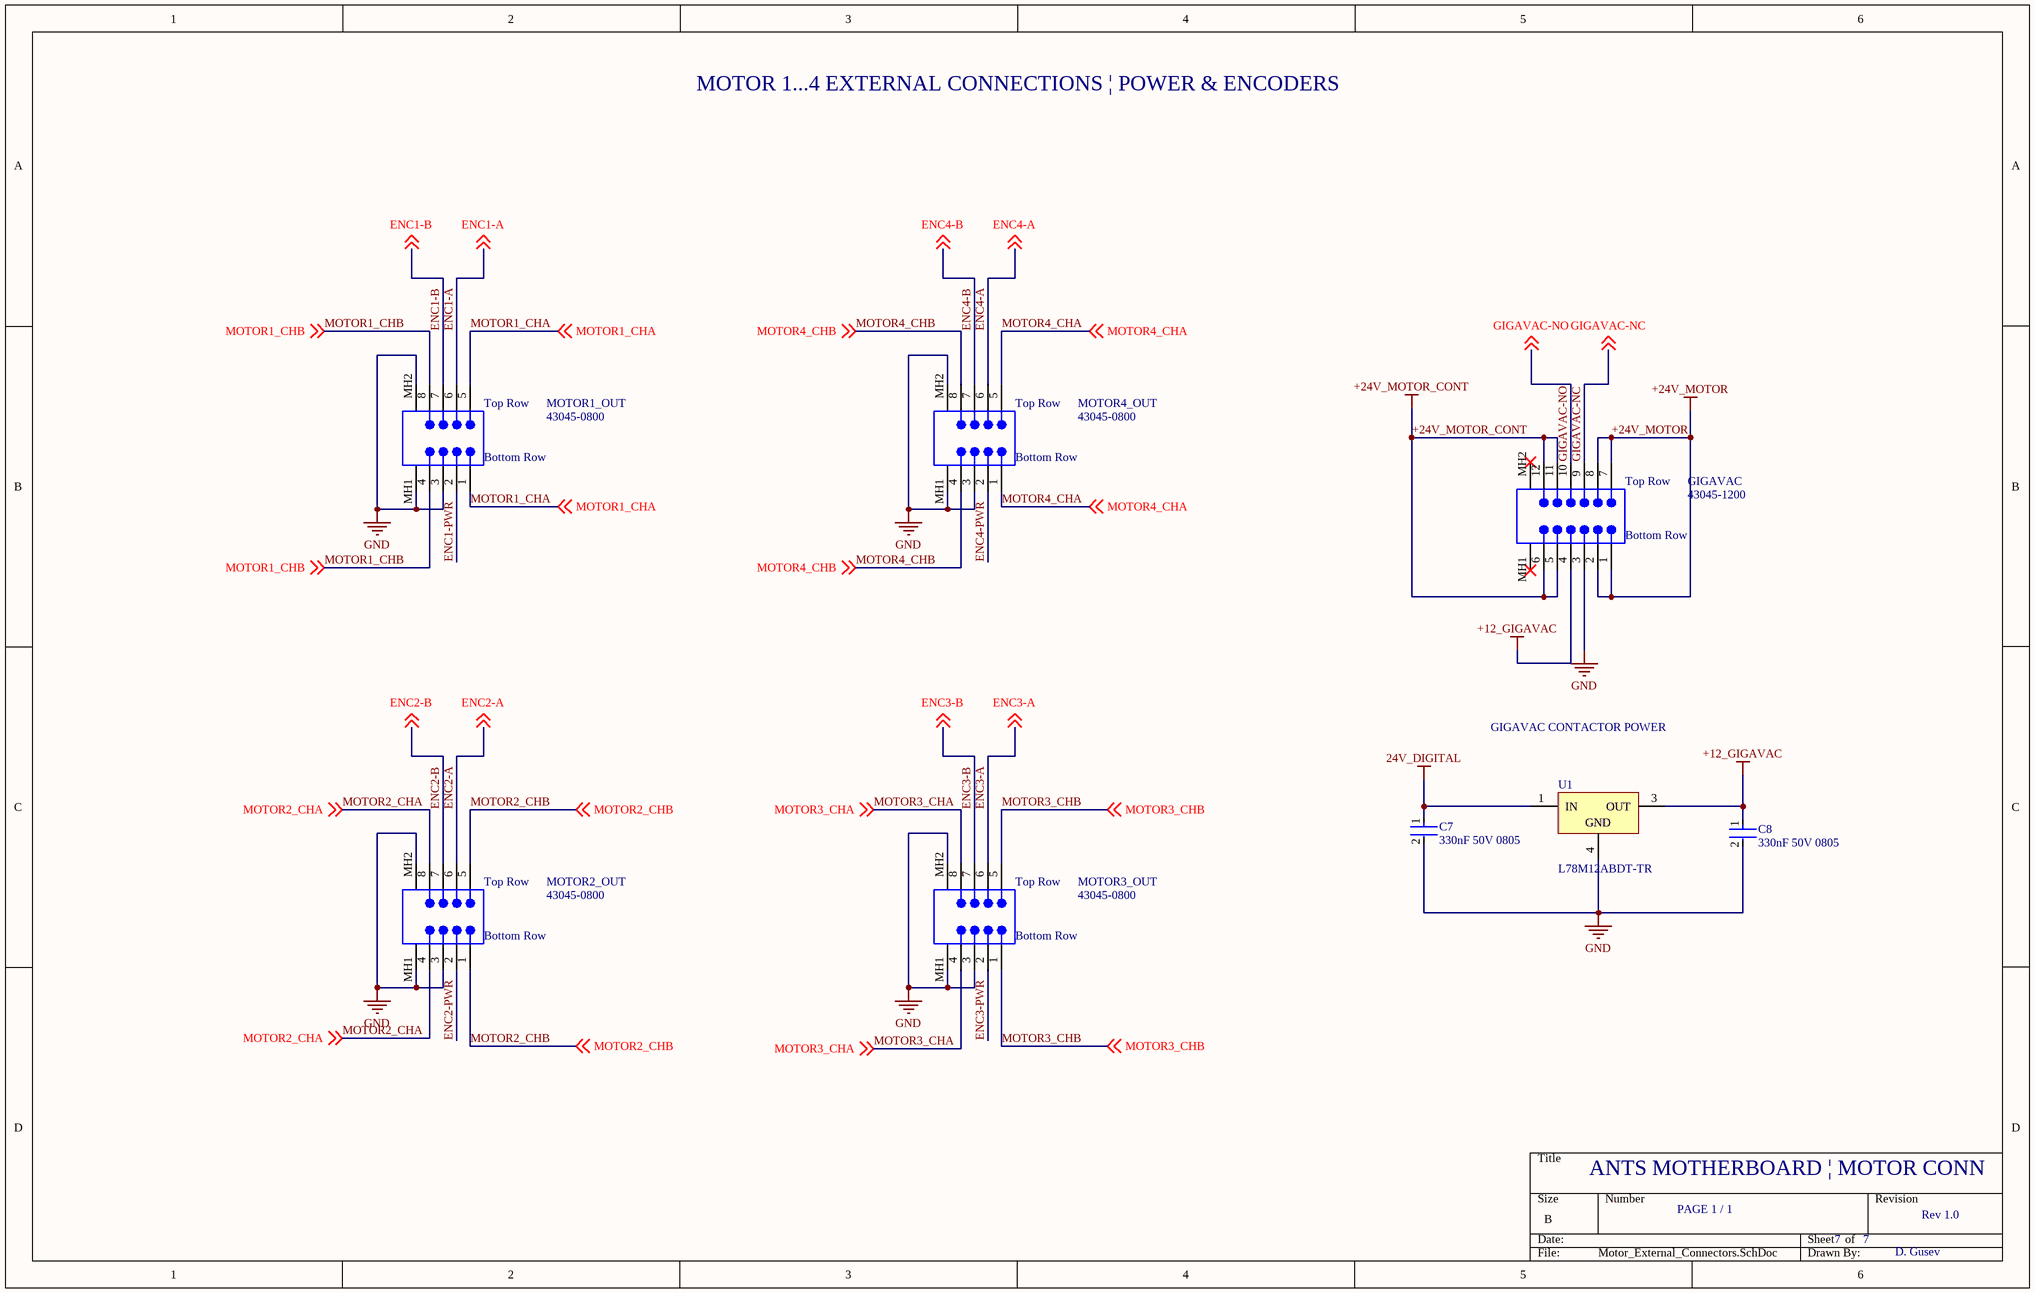
[diagram p5: Motor_External_Connectors.SchDoc]

### Parts
C7  330nF 50V 0805  [FP-C0805C-DN-MFG]
C8  330nF 50V 0805  [FP-C0805C-DN-MFG]
GIGAVAC  43045-1200  [MOLX-43045-1200]
MOTOR1_OUT  43045-0800  [MOLX-43045-0800]
MOTOR2_OUT  43045-0800  [MOLX-43045-0800]
MOTOR3_OUT  43045-0800  [MOLX-43045-0800]
MOTOR4_OUT  43045-0800  [MOLX-43045-0800]
U1  L78M12ABDT-TR  [TO-252_M]

### Nets
24V_DIGITAL: C7.1 U1.1(IN)  [project net +24V_DIGITAL]
+12_GIGAVAC: C8.1 GIGAVAC.4 U1.3(OUT)
+24V_MOTOR: GIGAVAC.1 GIGAVAC.2 GIGAVAC.7 GIGAVAC.8
+24V_MOTOR_CONT: GIGAVAC.5 GIGAVAC.6 GIGAVAC.11 GIGAVAC.12
GND: C7.2 C8.2 GIGAVAC.3 MOTOR1_OUT.3 MOTOR1_OUT.MH1 MOTOR1_OUT.MH2 MOTOR2_OUT.3 MOTOR2_OUT.MH1 MOTOR2_OUT.MH2 MOTOR3_OUT.3 MOTOR3_OUT.MH1 MOTOR3_OUT.MH2 MOTOR4_OUT.3 MOTOR4_OUT.MH1 MOTOR4_OUT.MH2 U1.4(GND)
ENC1-A: MOTOR1_OUT.6 ; off-sheet ENC1-A
ENC1-B: MOTOR1_OUT.7 ; off-sheet ENC1-B
ENC1-PWR: MOTOR1_OUT.2
ENC2-A: MOTOR2_OUT.6 ; off-sheet ENC2-A
ENC2-B: MOTOR2_OUT.7 ; off-sheet ENC2-B
ENC2-PWR: MOTOR2_OUT.2
ENC3-A: MOTOR3_OUT.6 ; off-sheet ENC3-A
ENC3-B: MOTOR3_OUT.7 ; off-sheet ENC3-B
ENC3-PWR: MOTOR3_OUT.2
ENC4-A: MOTOR4_OUT.6 ; off-sheet ENC4-A
ENC4-B: MOTOR4_OUT.7 ; off-sheet ENC4-B
ENC4-PWR: MOTOR4_OUT.2
GIGAVAC-NC: GIGAVAC.9 ; off-sheet GIGAVAC-NC
GIGAVAC-NO: GIGAVAC.10 ; off-sheet GIGAVAC-NO
MOTOR1_CHA: MOTOR1_OUT.1 MOTOR1_OUT.5 ; off-sheet MOTOR1_CHA
MOTOR1_CHB: MOTOR1_OUT.4 MOTOR1_OUT.8 ; off-sheet MOTOR1_CHB
MOTOR2_CHA: MOTOR2_OUT.4 MOTOR2_OUT.8 ; off-sheet MOTOR2_CHA
MOTOR2_CHB: MOTOR2_OUT.1 MOTOR2_OUT.5 ; off-sheet MOTOR2_CHB
MOTOR3_CHA: MOTOR3_OUT.4 MOTOR3_OUT.8 ; off-sheet MOTOR3_CHA
MOTOR3_CHB: MOTOR3_OUT.1 MOTOR3_OUT.5 ; off-sheet MOTOR3_CHB
MOTOR4_CHA: MOTOR4_OUT.1 MOTOR4_OUT.5 ; off-sheet MOTOR4_CHA
MOTOR4_CHB: MOTOR4_OUT.4 MOTOR4_OUT.8 ; off-sheet MOTOR4_CHB

Not connected (* = marked no-connect by the designer): GIGAVAC MH1* MH2*

### Notes on the sheet
- MOTOR 1...4 EXTERNAL CONNECTIONS | POWER & ENCODERS
- GIGAVAC CONTACTOR POWER
- ANTS MOTHERBOARD | MOTOR CONN
- PAGE 1 / 1
- 7
- Rev 1.0
- D. Gusev
- (in symbol Molex 0430450-800) Top Row; Bottom Row
- (in symbol Molex 0430451-200) Top Row; Bottom Row

### Library data of the parts
C7 C8 = CMP-1036-04607-3: CAP CER 0.33UF 50V X7R 0805; Manufacturer Part Number: C0805C334K5RACTU; Manufacturer: KEMET; Temperature Coefficient: 30ppm/°C; Value: 0.33 μF; Material: Ceramic; Tolerance: 0.1; Temperature: -55°C to +125°C; Temperature Range Low: -55°C; Voltage Rating: 50 V; Lead Free: Yes; Mouser Description: Multilayer Ceramic Capacitors MLCC - SMD/SMT 50volts 0.33uF 10% X7R; Automotive: No; Package: C0805C-DN; Temperature Characteristic: X7R; Capacitance: 0.33 μF; Digikey Description: CAP CER 0.33UF 50V X7R 0805; Device Class L3: Ceramic Capacitors; Temperature Range High: +125°C; Category: Cap; Ipc Land Pattern Name: CAPC200125X78; ComponentLink2URL: https://content.kemet.com/datasheets/KEM_C1003_C0G_SMD.pdf; ComponentLink2Description: Datasheet; RoHS: TRUE; Device Class L1: Passive Components; Height: 0.88mm; Octopart: https://octopart.com/c0805c334k5ractu-kemet-10475704; Device Class L2: Capacitors
GIGAVAC = Molex 0430451-200: 3 mm Pitch Micro-Fit 3.0 Connector, 17.27 mm Mated Height, Vertical, Through Hole, 12 Circuits, -40 to 105 degC, RoHS, Tray; PartNumber: 43045-0812; Pitch: 3 mm; No. of Positions: 8; No. of Rows: 2; ComponentLink2Description: Datasheet; ComponentLink2URL: http://www.molex.com/webdocs/datasheets/pdf/en-us/0430450812_PCB_HEADERS.pdf; Orientation: Vertical; Packing: Tray; Temperature Min: -40 degC; RoHS: TRUE; ComponentLink3Description: Package Specification; Temperature Max: 105 degC; ComponentLink3URL: http://www.molex.com/pdm_docs/sd/430450812_sd.pdf; Mounting Technology: Through Hole; PackageVersion: Rev. F, 06/2009; ComponentLink1Description: Manufacturer URL; PackageDescription: 8-Pin PCB Header, Vertical, Pitch 3 mm, Mated Height 17.27 mm, Through Hole; ComponentLink1URL: http://www.molex.com/
MOTOR1_OUT MOTOR2_OUT MOTOR3_OUT MOTOR4_OUT = Molex 0430450-800: 3 mm Pitch Micro-Fit 3.0 Connector, 17.27 mm Mated Height, Vertical, Through Hole, 8 Circuits, -40 to 105 degC, RoHS, Tray; PartNumber: 43045-0812; Pitch: 3 mm; No. of Positions: 8; No. of Rows: 2; ComponentLink2Description: Datasheet; ComponentLink2URL: http://www.molex.com/webdocs/datasheets/pdf/en-us/0430450812_PCB_HEADERS.pdf; Orientation: Vertical; Packing: Tray; Temperature Min: -40 degC; RoHS: TRUE; ComponentLink3Description: Package Specification; Temperature Max: 105 degC; ComponentLink3URL: http://www.molex.com/pdm_docs/sd/430450812_sd.pdf; Mounting Technology: Through Hole; PackageVersion: Rev. F, 06/2009; ComponentLink1Description: Manufacturer URL; PackageDescription: 8-Pin PCB Header, Vertical, Pitch 3 mm, Mated Height 17.27 mm, Through Hole; ComponentLink1URL: http://www.molex.com/
U1 = CMP-0244-00186-1: Precision 500mA Regulator, 12V, 3-Pin DPAK, Tape and Reel; ComponentLink2Description: Datasheet; PackageDescription: 3-Pin Transistor Outline Package 2.28 mm Pitch, 9.7 mm Lead Span (DPAK); PackageVersion: 2011; ComponentLink2URL: http://www.st.com/internet/com/TECHNICAL_RESOURCES/TECHNICAL_LITERATURE/DATASHEET/CD00000448.pdf; ComponentLink1URL: http://www.st.com; PackageReference: TO-252; DatasheetVersion: 1/11/2010; ComponentLink1Description: Manufacturer URL

## Sheet PCU_PCIe.SchDoc
size B
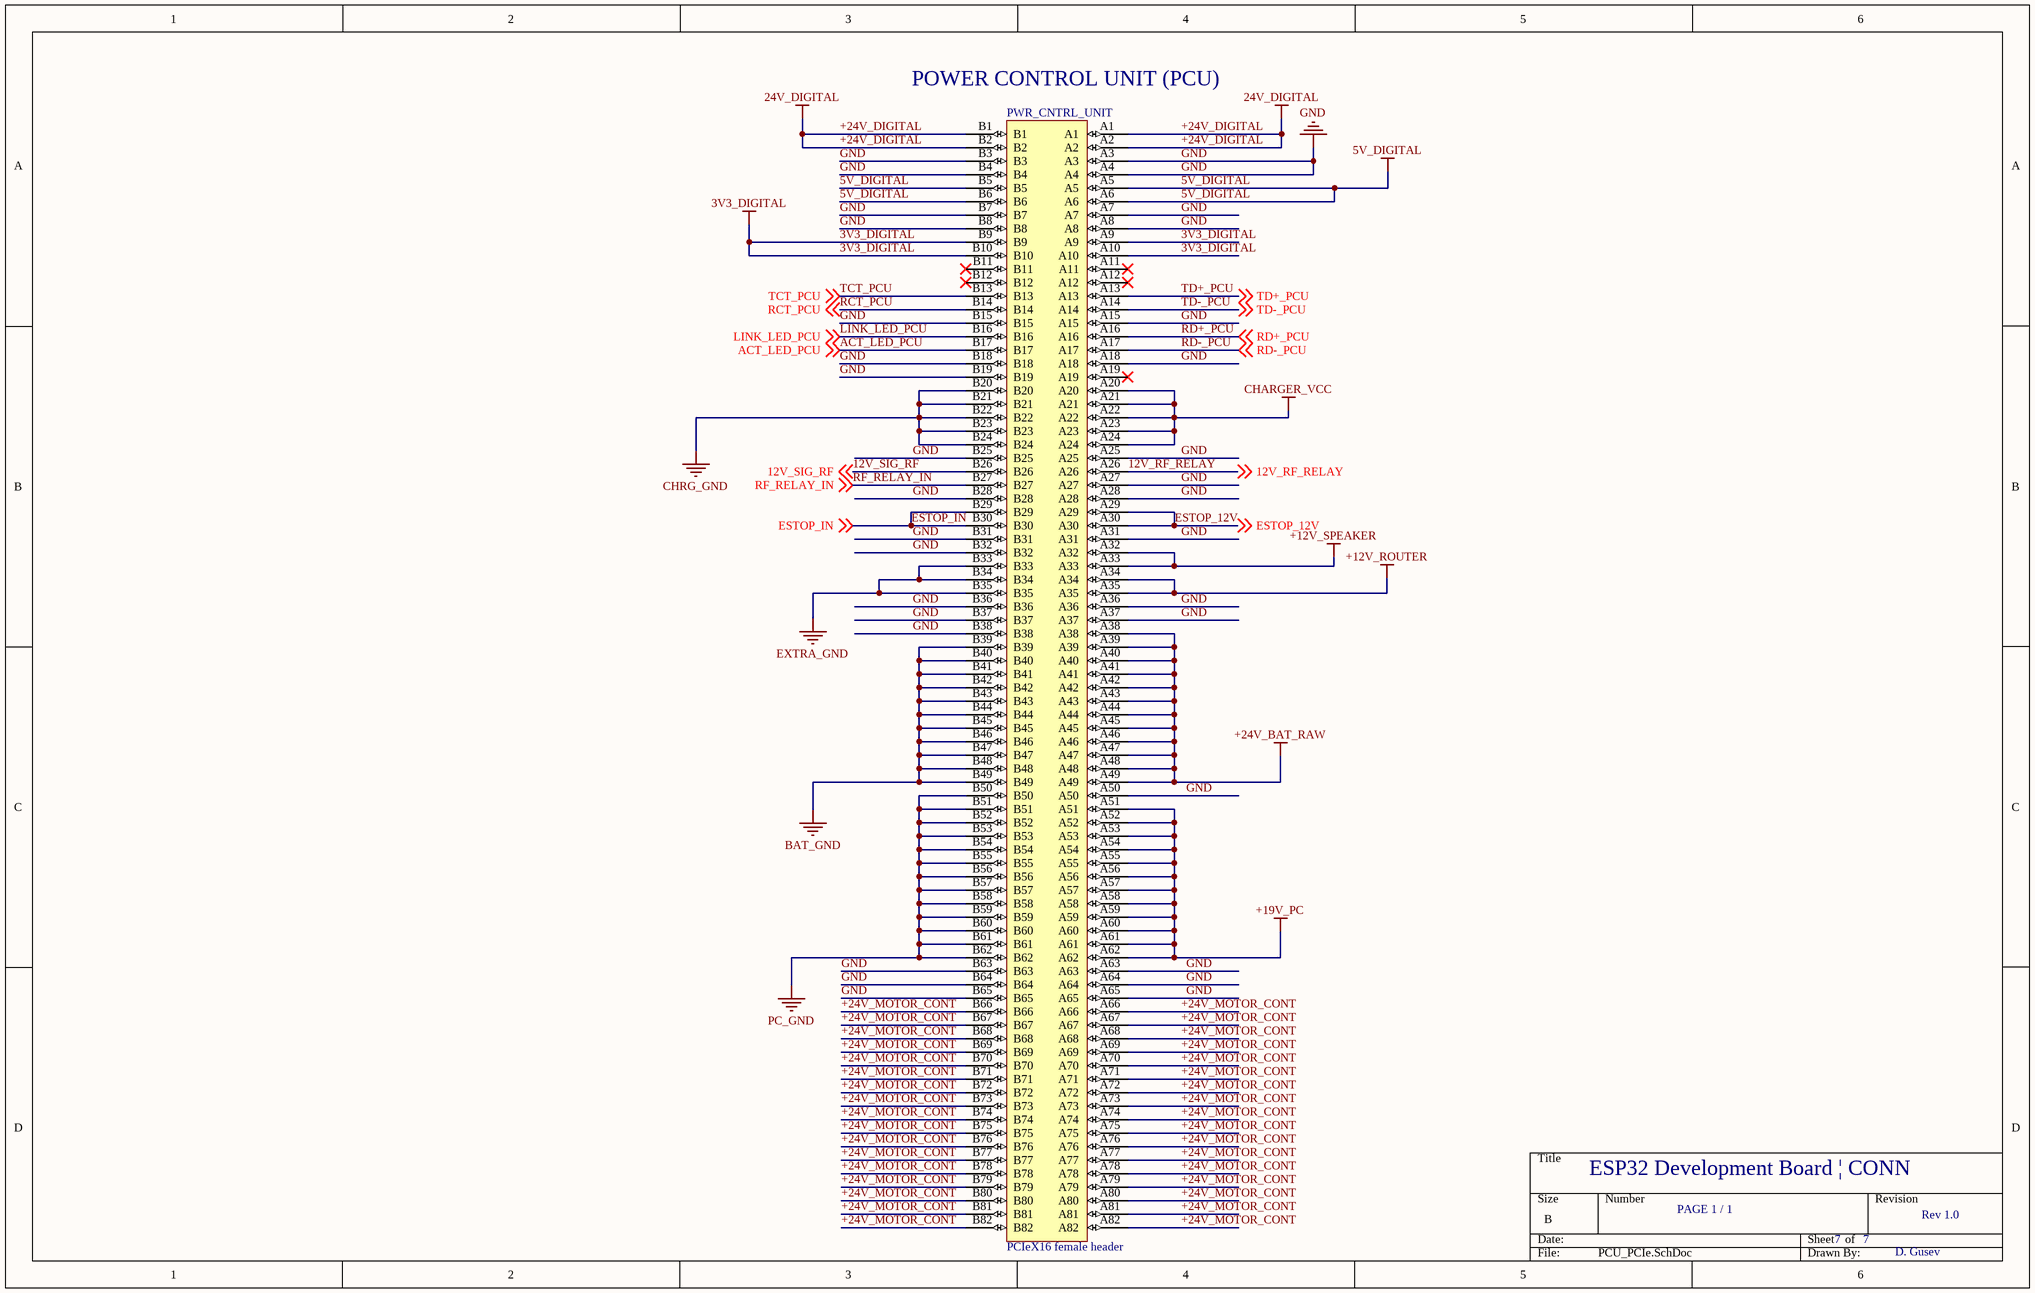
[diagram p6: PCU_PCIe.SchDoc]

### Parts
PWR_CNTRL_UNIT  PCIeX16 female header  [SAMTEC_PCIE-164-02-X-D-TH]

### Nets
3V3_DIGITAL: PWR_CNTRL_UNIT.A9 PWR_CNTRL_UNIT.A10 PWR_CNTRL_UNIT.B9 PWR_CNTRL_UNIT.B10
5V_DIGITAL: PWR_CNTRL_UNIT.A5 PWR_CNTRL_UNIT.A6 PWR_CNTRL_UNIT.B5 PWR_CNTRL_UNIT.B6
+12V_ROUTER: PWR_CNTRL_UNIT.A34 PWR_CNTRL_UNIT.A35
+12V_SPEAKER: PWR_CNTRL_UNIT.A32 PWR_CNTRL_UNIT.A33
+19V_PC: PWR_CNTRL_UNIT.A51 PWR_CNTRL_UNIT.A52 PWR_CNTRL_UNIT.A53 PWR_CNTRL_UNIT.A54 PWR_CNTRL_UNIT.A55 PWR_CNTRL_UNIT.A56 PWR_CNTRL_UNIT.A57 PWR_CNTRL_UNIT.A58 PWR_CNTRL_UNIT.A59 PWR_CNTRL_UNIT.A60 PWR_CNTRL_UNIT.A61 PWR_CNTRL_UNIT.A62
+24V_BAT_RAW: PWR_CNTRL_UNIT.A38 PWR_CNTRL_UNIT.A39 PWR_CNTRL_UNIT.A40 PWR_CNTRL_UNIT.A41 PWR_CNTRL_UNIT.A42 PWR_CNTRL_UNIT.A43 PWR_CNTRL_UNIT.A44 PWR_CNTRL_UNIT.A45 PWR_CNTRL_UNIT.A46 PWR_CNTRL_UNIT.A47 PWR_CNTRL_UNIT.A48 PWR_CNTRL_UNIT.A49
+24V_DIGITAL: PWR_CNTRL_UNIT.A1 PWR_CNTRL_UNIT.A2 PWR_CNTRL_UNIT.B1 PWR_CNTRL_UNIT.B2  [also labelled 24V_DIGITAL]
+24V_MOTOR_CONT: PWR_CNTRL_UNIT.A66 PWR_CNTRL_UNIT.A67 PWR_CNTRL_UNIT.A68 PWR_CNTRL_UNIT.A69 PWR_CNTRL_UNIT.A70 PWR_CNTRL_UNIT.A71 PWR_CNTRL_UNIT.A72 PWR_CNTRL_UNIT.A73 PWR_CNTRL_UNIT.A74 PWR_CNTRL_UNIT.A75 PWR_CNTRL_UNIT.A76 PWR_CNTRL_UNIT.A77 PWR_CNTRL_UNIT.A78 PWR_CNTRL_UNIT.A79 PWR_CNTRL_UNIT.A80 PWR_CNTRL_UNIT.A81 PWR_CNTRL_UNIT.A82 PWR_CNTRL_UNIT.B66 PWR_CNTRL_UNIT.B67 PWR_CNTRL_UNIT.B68 PWR_CNTRL_UNIT.B69 PWR_CNTRL_UNIT.B70 PWR_CNTRL_UNIT.B71 PWR_CNTRL_UNIT.B72 PWR_CNTRL_UNIT.B73 PWR_CNTRL_UNIT.B74 PWR_CNTRL_UNIT.B75 PWR_CNTRL_UNIT.B76 PWR_CNTRL_UNIT.B77 PWR_CNTRL_UNIT.B78 PWR_CNTRL_UNIT.B79 PWR_CNTRL_UNIT.B80 PWR_CNTRL_UNIT.B81 PWR_CNTRL_UNIT.B82
BAT_GND: PWR_CNTRL_UNIT.B39 PWR_CNTRL_UNIT.B40 PWR_CNTRL_UNIT.B41 PWR_CNTRL_UNIT.B42 PWR_CNTRL_UNIT.B43 PWR_CNTRL_UNIT.B44 PWR_CNTRL_UNIT.B45 PWR_CNTRL_UNIT.B46 PWR_CNTRL_UNIT.B47 PWR_CNTRL_UNIT.B48 PWR_CNTRL_UNIT.B49
CHARGER_VCC: PWR_CNTRL_UNIT.A20 PWR_CNTRL_UNIT.A21 PWR_CNTRL_UNIT.A22 PWR_CNTRL_UNIT.A23 PWR_CNTRL_UNIT.A24
CHRG_GND: PWR_CNTRL_UNIT.B20 PWR_CNTRL_UNIT.B21 PWR_CNTRL_UNIT.B22 PWR_CNTRL_UNIT.B23 PWR_CNTRL_UNIT.B24
EXTRA_GND: PWR_CNTRL_UNIT.B33 PWR_CNTRL_UNIT.B34 PWR_CNTRL_UNIT.B35
GND: PWR_CNTRL_UNIT.A3 PWR_CNTRL_UNIT.A4 PWR_CNTRL_UNIT.A7 PWR_CNTRL_UNIT.A8 PWR_CNTRL_UNIT.A15 PWR_CNTRL_UNIT.A18 PWR_CNTRL_UNIT.A25 PWR_CNTRL_UNIT.A27 PWR_CNTRL_UNIT.A28 PWR_CNTRL_UNIT.A31 PWR_CNTRL_UNIT.A36 PWR_CNTRL_UNIT.A37 PWR_CNTRL_UNIT.A50 PWR_CNTRL_UNIT.A63 PWR_CNTRL_UNIT.A64 PWR_CNTRL_UNIT.A65 PWR_CNTRL_UNIT.B3 PWR_CNTRL_UNIT.B4 PWR_CNTRL_UNIT.B7 PWR_CNTRL_UNIT.B8 PWR_CNTRL_UNIT.B15 PWR_CNTRL_UNIT.B18 PWR_CNTRL_UNIT.B19 PWR_CNTRL_UNIT.B25 PWR_CNTRL_UNIT.B28 PWR_CNTRL_UNIT.B31 PWR_CNTRL_UNIT.B32 PWR_CNTRL_UNIT.B36 PWR_CNTRL_UNIT.B37 PWR_CNTRL_UNIT.B38 PWR_CNTRL_UNIT.B63 PWR_CNTRL_UNIT.B64 PWR_CNTRL_UNIT.B65
PC_GND: PWR_CNTRL_UNIT.B50 PWR_CNTRL_UNIT.B51 PWR_CNTRL_UNIT.B52 PWR_CNTRL_UNIT.B53 PWR_CNTRL_UNIT.B54 PWR_CNTRL_UNIT.B55 PWR_CNTRL_UNIT.B56 PWR_CNTRL_UNIT.B57 PWR_CNTRL_UNIT.B58 PWR_CNTRL_UNIT.B59 PWR_CNTRL_UNIT.B60 PWR_CNTRL_UNIT.B61 PWR_CNTRL_UNIT.B62
12V_RF_RELAY: PWR_CNTRL_UNIT.A26 ; off-sheet 12V_RF_RELAY
12V_SIG_RF: PWR_CNTRL_UNIT.B26 ; off-sheet 12V_SIG_RF
ACT_LED_PCU: PWR_CNTRL_UNIT.B17 ; off-sheet ACT_LED_PCU
ESTOP_12V: PWR_CNTRL_UNIT.A29 PWR_CNTRL_UNIT.A30 ; off-sheet ESTOP_12V
ESTOP_IN: PWR_CNTRL_UNIT.B29 PWR_CNTRL_UNIT.B30 ; off-sheet ESTOP_IN
LINK_LED_PCU: PWR_CNTRL_UNIT.B16 ; off-sheet LINK_LED_PCU
RCT_PCU: PWR_CNTRL_UNIT.B14 ; off-sheet RCT_PCU
RD+_PCU: PWR_CNTRL_UNIT.A16 ; off-sheet RD+_PCU
RD-_PCU: PWR_CNTRL_UNIT.A17 ; off-sheet RD-_PCU
RF_RELAY_IN: PWR_CNTRL_UNIT.B27 ; off-sheet RF_RELAY_IN
TCT_PCU: PWR_CNTRL_UNIT.B13 ; off-sheet TCT_PCU
TD+_PCU: PWR_CNTRL_UNIT.A13 ; off-sheet TD+_PCU
TD-_PCU: PWR_CNTRL_UNIT.A14 ; off-sheet TD-_PCU

Not connected (* = marked no-connect by the designer): PWR_CNTRL_UNIT A11* A12* A19* B11* B12*

### Notes on the sheet
- (near PWR_CNTRL_UNIT) POWER CONTROL UNIT (PCU)
- ESP32 Development Board | CONN
- PAGE 1 / 1
- 7
- Rev 1.0
- D. Gusev

### Library data of the parts
PWR_CNTRL_UNIT = PCIeX16 female header: 164-position SAMTEC female header

## Sheet Power_External_Connectors.SchDoc
size B
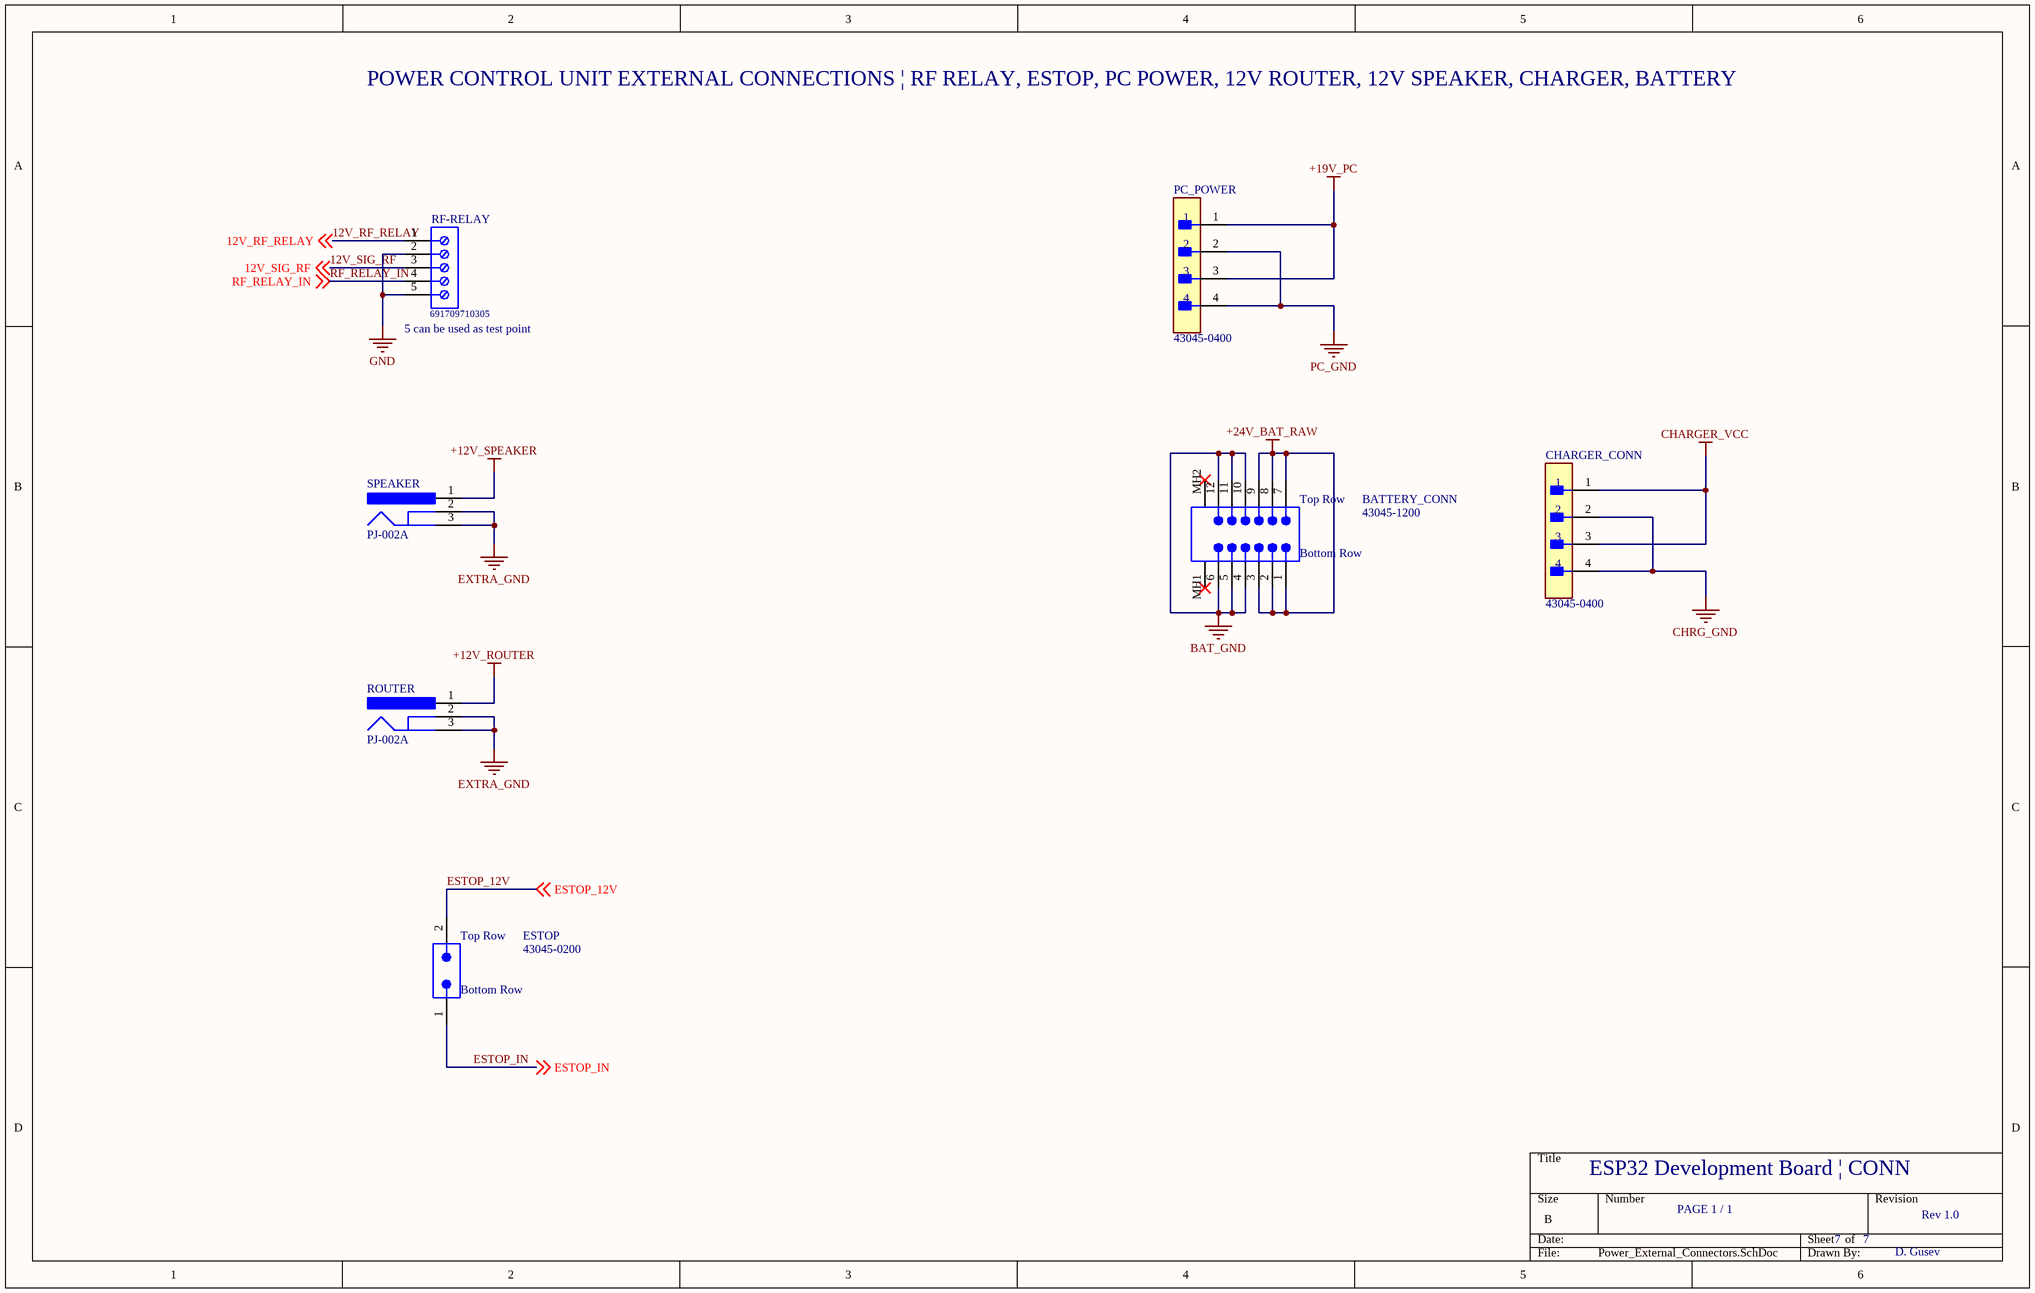
[diagram p7: Power_External_Connectors.SchDoc]

### Parts
BATTERY_CONN  43045-1200  [MOLX-43045-1200]
CHARGER_CONN  43045-0400  [FP-43045-0400-MFG]
ESTOP  43045-0200  [MOLX-43045-0200]
PC_POWER  43045-0400  [FP-43045-0400-MFG]
RF-RELAY  691709710305  [691709710305]
ROUTER  PJ-002A  [CUI-PJ-002A_V]
SPEAKER  PJ-002A  [CUI-PJ-002A_V]

### Nets
+12V_ROUTER: ROUTER.1
+12V_SPEAKER: SPEAKER.1
+19V_PC: PC_POWER.1 PC_POWER.3
+24V_BAT_RAW: BATTERY_CONN.1 BATTERY_CONN.2 BATTERY_CONN.3 BATTERY_CONN.7 BATTERY_CONN.8 BATTERY_CONN.9
BAT_GND: BATTERY_CONN.4 BATTERY_CONN.5 BATTERY_CONN.6 BATTERY_CONN.10 BATTERY_CONN.11 BATTERY_CONN.12
CHARGER_VCC: CHARGER_CONN.1 CHARGER_CONN.3
CHRG_GND: CHARGER_CONN.2 CHARGER_CONN.4
EXTRA_GND: ROUTER.2 ROUTER.3 SPEAKER.2 SPEAKER.3
GND: RF-RELAY.2 RF-RELAY.5
PC_GND: PC_POWER.2 PC_POWER.4
12V_RF_RELAY: RF-RELAY.1 ; off-sheet 12V_RF_RELAY
12V_SIG_RF: RF-RELAY.3 ; off-sheet 12V_SIG_RF
ESTOP_12V: ESTOP.2 ; off-sheet ESTOP_12V
ESTOP_IN: ESTOP.1 ; off-sheet ESTOP_IN
RF_RELAY_IN: RF-RELAY.4 ; off-sheet RF_RELAY_IN

Not connected (* = marked no-connect by the designer): BATTERY_CONN MH1* MH2*

### Notes on the sheet
- POWER CONTROL UNIT EXTERNAL CONNECTIONS | RF RELAY, ESTOP, PC POWER, 12V ROUTER, 12V SPEAKER, CHARGER, BATTERY
- (near RF-RELAY) 5 can be used as test point
- ESP32 Development Board | CONN
- PAGE 1 / 1
- 7
- Rev 1.0
- D. Gusev
- (in symbol Molex 0430450-200) Top Row; Bottom Row
- (in symbol Molex 0430451-200) Top Row; Bottom Row

### Library data of the parts
BATTERY_CONN = Molex 0430451-200: as GIGAVAC on sheet Motor_External_Connectors; ComponentLink2Description: Datasheet; ComponentLink2URL: http://www.molex.com/webdocs/datasheets/pdf/en-us/0430450812_PCB_HEADERS.pdf; Orientation: Vertical; Packing: Tray; Temperature Min: -40 degC; RoHS: TRUE; ComponentLink3Description: Package Specification; Temperature Max: 105 degC; ComponentLink3URL: http://www.molex.com/pdm_docs/sd/430450812_sd.pdf; Mounting Technology: Through Hole; PackageVersion: Rev. F, 06/2009; ComponentLink1Description: Manufacturer URL; PackageDescription: 8-Pin PCB Header, Vertical, Pitch 3 mm, Mated Height 17.27 mm, Through Hole; ComponentLink1URL: http://www.molex.com/
CHARGER_CONN PC_POWER = CMP-04776-000002-1: CONN HEADER R/A 4POS 3MM; Manufacturer: Molex; Conn Gender: Male; Conn Orientation: Right Angle; Voltage Rating: 600V; Number Of Contacts: 4; Is Female: yes; Current Rating: 8.5A; ComponentLink2URL: https://www.molex.com/webdocs/datasheets/pdf/en-us/0430450400_PCB_HEADERS.pdf; Manufacturer Part Number: 43045-0400; Digikey Description: CONN HEADER R/A 4POS 3MM; Category: Conn; Temperature Range High: +105°C; Lead Free: Yes; Device Class L1: Connectors; Automotive: No; Temperature: -40°C to +105°C; Footprint Url: https://www.molex.com/pdm_docs/sd/430450400_sd.pdf; Height: 9.27mm; Number Of Rows: 2; Device Class L3: unset; Pitch: 3mm; Temperature Range Low: -40°C; Contact Material: Tin,Nickel; Octopart: https://octopart.com/43045-0400-molex-287063; RoHS: TRUE; ComponentLink2Description: Datasheet; Package: 43045-0400; Device Class L2: Headers and Wire Housings
ESTOP = Molex 0430450-200: 3 mm Pitch Micro-Fit 3.0 Connector, 17.27 mm Mated Height, Vertical, Through Hole, 2 Circuits, -40 to 105 degC, RoHS, Tray; PartNumber: 43045-0812; Pitch: 3 mm; No. of Positions: 8; No. of Rows: 2; ComponentLink2Description: Datasheet; ComponentLink2URL: http://www.molex.com/webdocs/datasheets/pdf/en-us/0430450812_PCB_HEADERS.pdf; Orientation: Vertical; Packing: Tray; Temperature Min: -40 degC; RoHS: TRUE; ComponentLink3Description: Package Specification; Temperature Max: 105 degC; ComponentLink3URL: http://www.molex.com/pdm_docs/sd/430450812_sd.pdf; Mounting Technology: Through Hole; PackageVersion: Rev. F, 06/2009; ComponentLink1Description: Manufacturer URL; PackageDescription: 8-Pin PCB Header, Vertical, Pitch 3 mm, Mated Height 17.27 mm, Through Hole; ComponentLink1URL: http://www.molex.com/
RF-RELAY = CMP-1502-03338-1: Serie 7097 - 5.00 mm Horizontal Entry SMT with Pressure Clamp WR-TBL, 5 pin; Manufacturer: Wurth Elektronik; Pitch: 5.00mm; Pin Number: 5; Packaging: TapeandReelwithCap; Operating Temperature: -45to130degC; Mounting Technology: SMT; Part Number: 691709710305; Publisher: WurthElektronik; Manufacturer URL: http://www.we-online.de; Datasheet URL: http://katalog.we-online.de/em/datasheet/6917097103xx.pdf; Package Reference: 691709710305
ROUTER SPEAKER = CMP-2000-06895-1: Through Hole Right Angle DC Power Jack, 2.5 A, 2 mm Center Pin, 3 Position, -25 to 85 degC, RoHS, Bulk; Manufacturer: CUIInc.; Current Rating: 2.5A; Inside Contact Diameter: 2mm; Insulation Resistance: 50MOhms; Outside Contact Diameter: 6.5mm; Voltage Rating: 24V; Brand: CUI; Operating Temperature Range: -25Cto+85C; Mounting Technology: ThroughHole; Connector Type: DCPowerJack; Contact Material: Copper; Datasheet URL: http://www.cui.com/product/resource/pj-002a.pdf; Contact Gender: Male; Housing Material: PolybutyleneTerephthalate(PBT); Manufacturer URL: http://www.cui.com/; Package Reference: PJ-002A; Mounting Style: ThroughHole; Mounting Angle: Right; Product Category: DCPowerConnectors; Product: Jacks; Flammability Rating: UL94V-0; Contact Plating: Nickel; RoHS: True; Datasheet Version: Rev. 1.03, 04/2016; Package Description: 3-Pin Through Hole Device, Body 14.4 x 9 mm, Height 11 mm; Factory Pack Quantity: 500; Termination Style: ThroughHole

## Sheet SCU_External_Connectors.SchDoc
size B
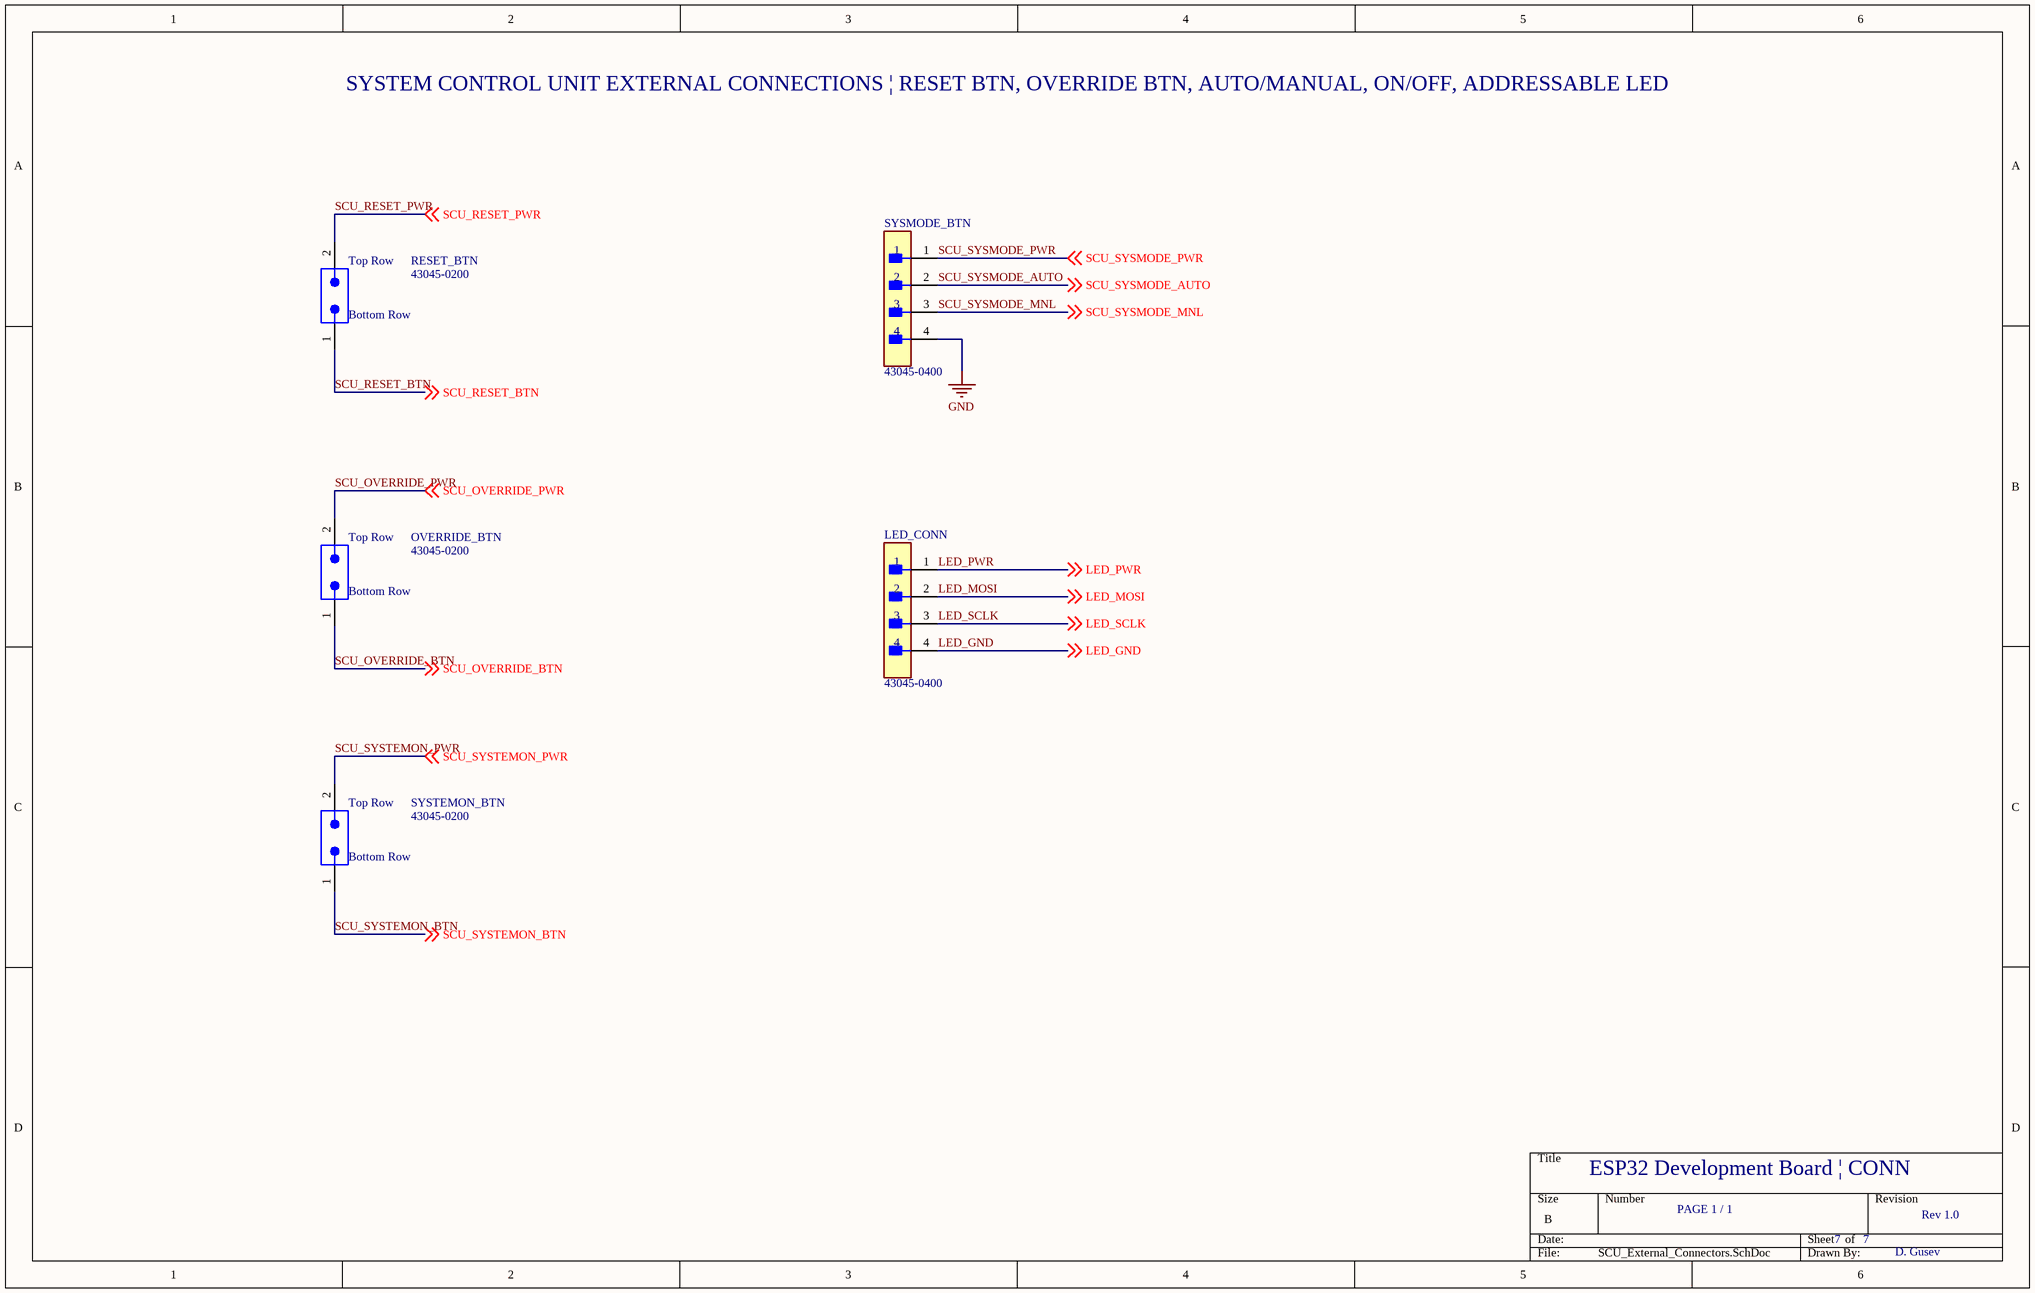
[diagram p8: SCU_External_Connectors.SchDoc]

### Parts
LED_CONN  43045-0400  [FP-43045-0400-MFG]
OVERRIDE_BTN  43045-0200  [MOLX-43045-0200]
RESET_BTN  43045-0200  [MOLX-43045-0200]
SYSMODE_BTN  43045-0400  [FP-43045-0400-MFG]
SYSTEMON_BTN  43045-0200  [MOLX-43045-0200]

### Nets
GND: SYSMODE_BTN.4
LED_GND: LED_CONN.4 ; off-sheet LED_GND
LED_MOSI: LED_CONN.2 ; off-sheet LED_MOSI
LED_PWR: LED_CONN.1 ; off-sheet LED_PWR
LED_SCLK: LED_CONN.3 ; off-sheet LED_SCLK
SCU_OVERRIDE_BTN: OVERRIDE_BTN.1 ; off-sheet SCU_OVERRIDE_BTN
SCU_OVERRIDE_PWR: OVERRIDE_BTN.2 ; off-sheet SCU_OVERRIDE_PWR
SCU_RESET_BTN: RESET_BTN.1 ; off-sheet SCU_RESET_BTN
SCU_RESET_PWR: RESET_BTN.2 ; off-sheet SCU_RESET_PWR
SCU_SYSMODE_AUTO: SYSMODE_BTN.2 ; off-sheet SCU_SYSMODE_AUTO
SCU_SYSMODE_MNL: SYSMODE_BTN.3 ; off-sheet SCU_SYSMODE_MNL
SCU_SYSMODE_PWR: SYSMODE_BTN.1 ; off-sheet SCU_SYSMODE_PWR
SCU_SYSTEMON_BTN: SYSTEMON_BTN.1 ; off-sheet SCU_SYSTEMON_BTN
SCU_SYSTEMON_PWR: SYSTEMON_BTN.2 ; off-sheet SCU_SYSTEMON_PWR

### Notes on the sheet
- SYSTEM CONTROL UNIT EXTERNAL CONNECTIONS | RESET BTN, OVERRIDE BTN, AUTO/MANUAL, ON/OFF, ADDRESSABLE LED
- ESP32 Development Board | CONN
- PAGE 1 / 1
- 7
- Rev 1.0
- D. Gusev
- (in symbol Molex 0430450-200) Top Row; Bottom Row

### Library data of the parts
LED_CONN SYSMODE_BTN = CMP-04776-000002-1: as CHARGER_CONN on sheet Power_External_Connectors; ComponentLink2URL: https://www.molex.com/webdocs/datasheets/pdf/en-us/0430450400_PCB_HEADERS.pdf; Manufacturer Part Number: 43045-0400; Digikey Description: CONN HEADER R/A 4POS 3MM; Category: Conn; Temperature Range High: +105°C; Lead Free: Yes; Device Class L1: Connectors; Automotive: No; Temperature: -40°C to +105°C; Footprint Url: https://www.molex.com/pdm_docs/sd/430450400_sd.pdf; Height: 9.27mm; Number Of Rows: 2; Device Class L3: unset; Pitch: 3mm; Temperature Range Low: -40°C; Contact Material: Tin,Nickel; Octopart: https://octopart.com/43045-0400-molex-287063; RoHS: TRUE; ComponentLink2Description: Datasheet; Package: 43045-0400; Device Class L2: Headers and Wire Housings
OVERRIDE_BTN RESET_BTN SYSTEMON_BTN = Molex 0430450-200: as ESTOP on sheet Power_External_Connectors; ComponentLink2Description: Datasheet; ComponentLink2URL: http://www.molex.com/webdocs/datasheets/pdf/en-us/0430450812_PCB_HEADERS.pdf; Orientation: Vertical; Packing: Tray; Temperature Min: -40 degC; RoHS: TRUE; ComponentLink3Description: Package Specification; Temperature Max: 105 degC; ComponentLink3URL: http://www.molex.com/pdm_docs/sd/430450812_sd.pdf; Mounting Technology: Through Hole; PackageVersion: Rev. F, 06/2009; ComponentLink1Description: Manufacturer URL; PackageDescription: 8-Pin PCB Header, Vertical, Pitch 3 mm, Mated Height 17.27 mm, Through Hole; ComponentLink1URL: http://www.molex.com/

## Sheet SCU_PCIe.SchDoc
size B
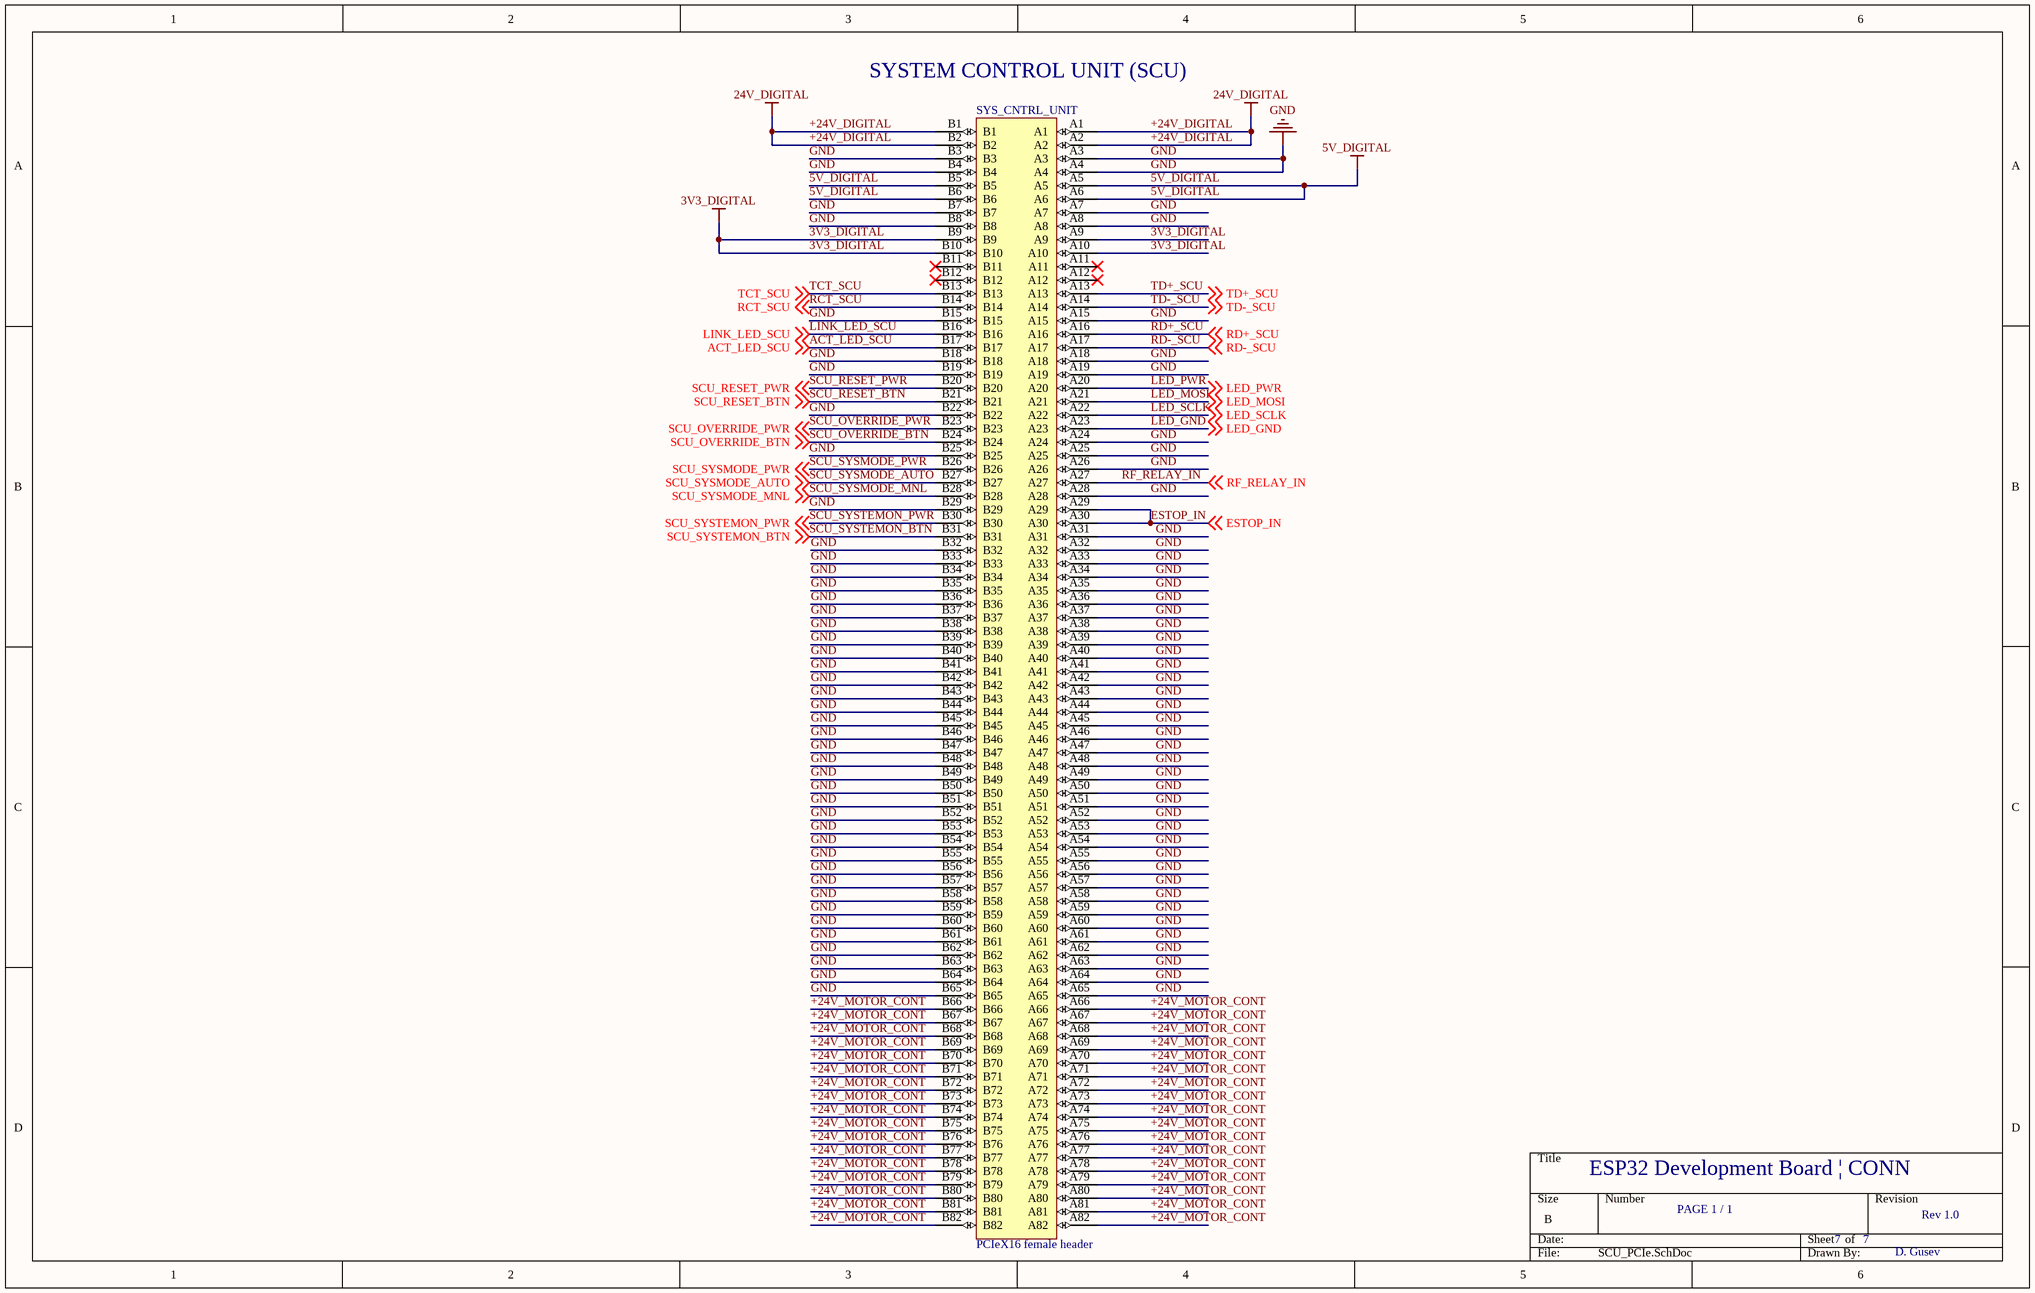
[diagram p9: SCU_PCIe.SchDoc]

### Parts
SYS_CNTRL_UNIT  PCIeX16 female header  [SAMTEC_PCIE-164-02-X-D-TH]

### Nets
3V3_DIGITAL: SYS_CNTRL_UNIT.A9 SYS_CNTRL_UNIT.A10 SYS_CNTRL_UNIT.B9 SYS_CNTRL_UNIT.B10
5V_DIGITAL: SYS_CNTRL_UNIT.A5 SYS_CNTRL_UNIT.A6 SYS_CNTRL_UNIT.B5 SYS_CNTRL_UNIT.B6
+24V_DIGITAL: SYS_CNTRL_UNIT.A1 SYS_CNTRL_UNIT.A2 SYS_CNTRL_UNIT.B1 SYS_CNTRL_UNIT.B2  [also labelled 24V_DIGITAL]
+24V_MOTOR_CONT: SYS_CNTRL_UNIT.A66 SYS_CNTRL_UNIT.A67 SYS_CNTRL_UNIT.A68 SYS_CNTRL_UNIT.A69 SYS_CNTRL_UNIT.A70 SYS_CNTRL_UNIT.A71 SYS_CNTRL_UNIT.A72 SYS_CNTRL_UNIT.A73 SYS_CNTRL_UNIT.A74 SYS_CNTRL_UNIT.A75 SYS_CNTRL_UNIT.A76 SYS_CNTRL_UNIT.A77 SYS_CNTRL_UNIT.A78 SYS_CNTRL_UNIT.A79 SYS_CNTRL_UNIT.A80 SYS_CNTRL_UNIT.A81 SYS_CNTRL_UNIT.A82 SYS_CNTRL_UNIT.B66 SYS_CNTRL_UNIT.B67 SYS_CNTRL_UNIT.B68 SYS_CNTRL_UNIT.B69 SYS_CNTRL_UNIT.B70 SYS_CNTRL_UNIT.B71 SYS_CNTRL_UNIT.B72 SYS_CNTRL_UNIT.B73 SYS_CNTRL_UNIT.B74 SYS_CNTRL_UNIT.B75 SYS_CNTRL_UNIT.B76 SYS_CNTRL_UNIT.B77 SYS_CNTRL_UNIT.B78 SYS_CNTRL_UNIT.B79 SYS_CNTRL_UNIT.B80 SYS_CNTRL_UNIT.B81 SYS_CNTRL_UNIT.B82
GND: SYS_CNTRL_UNIT.A3 SYS_CNTRL_UNIT.A4 SYS_CNTRL_UNIT.A7 SYS_CNTRL_UNIT.A8 SYS_CNTRL_UNIT.A15 SYS_CNTRL_UNIT.A18 SYS_CNTRL_UNIT.A19 SYS_CNTRL_UNIT.A24 SYS_CNTRL_UNIT.A25 SYS_CNTRL_UNIT.A26 SYS_CNTRL_UNIT.A28 SYS_CNTRL_UNIT.A31 SYS_CNTRL_UNIT.A32 SYS_CNTRL_UNIT.A33 SYS_CNTRL_UNIT.A34 SYS_CNTRL_UNIT.A35 SYS_CNTRL_UNIT.A36 SYS_CNTRL_UNIT.A37 SYS_CNTRL_UNIT.A38 SYS_CNTRL_UNIT.A39 SYS_CNTRL_UNIT.A40 SYS_CNTRL_UNIT.A41 SYS_CNTRL_UNIT.A42 SYS_CNTRL_UNIT.A43 SYS_CNTRL_UNIT.A44 SYS_CNTRL_UNIT.A45 SYS_CNTRL_UNIT.A46 SYS_CNTRL_UNIT.A47 SYS_CNTRL_UNIT.A48 SYS_CNTRL_UNIT.A49 SYS_CNTRL_UNIT.A50 SYS_CNTRL_UNIT.A51 SYS_CNTRL_UNIT.A52 SYS_CNTRL_UNIT.A53 SYS_CNTRL_UNIT.A54 SYS_CNTRL_UNIT.A55 SYS_CNTRL_UNIT.A56 SYS_CNTRL_UNIT.A57 SYS_CNTRL_UNIT.A58 SYS_CNTRL_UNIT.A59 SYS_CNTRL_UNIT.A60 SYS_CNTRL_UNIT.A61 SYS_CNTRL_UNIT.A62 SYS_CNTRL_UNIT.A63 SYS_CNTRL_UNIT.A64 SYS_CNTRL_UNIT.A65 SYS_CNTRL_UNIT.B3 SYS_CNTRL_UNIT.B4 SYS_CNTRL_UNIT.B7 SYS_CNTRL_UNIT.B8 SYS_CNTRL_UNIT.B15 SYS_CNTRL_UNIT.B18 SYS_CNTRL_UNIT.B19 SYS_CNTRL_UNIT.B22 SYS_CNTRL_UNIT.B25 SYS_CNTRL_UNIT.B29 SYS_CNTRL_UNIT.B32 SYS_CNTRL_UNIT.B33 SYS_CNTRL_UNIT.B34 SYS_CNTRL_UNIT.B35 SYS_CNTRL_UNIT.B36 SYS_CNTRL_UNIT.B37 SYS_CNTRL_UNIT.B38 SYS_CNTRL_UNIT.B39 SYS_CNTRL_UNIT.B40 SYS_CNTRL_UNIT.B41 SYS_CNTRL_UNIT.B42 SYS_CNTRL_UNIT.B43 SYS_CNTRL_UNIT.B44 SYS_CNTRL_UNIT.B45 SYS_CNTRL_UNIT.B46 SYS_CNTRL_UNIT.B47 SYS_CNTRL_UNIT.B48 SYS_CNTRL_UNIT.B49 SYS_CNTRL_UNIT.B50 SYS_CNTRL_UNIT.B51 SYS_CNTRL_UNIT.B52 SYS_CNTRL_UNIT.B53 SYS_CNTRL_UNIT.B54 SYS_CNTRL_UNIT.B55 SYS_CNTRL_UNIT.B56 SYS_CNTRL_UNIT.B57 SYS_CNTRL_UNIT.B58 SYS_CNTRL_UNIT.B59 SYS_CNTRL_UNIT.B60 SYS_CNTRL_UNIT.B61 SYS_CNTRL_UNIT.B62 SYS_CNTRL_UNIT.B63 SYS_CNTRL_UNIT.B64 SYS_CNTRL_UNIT.B65
ACT_LED_SCU: SYS_CNTRL_UNIT.B17 ; off-sheet ACT_LED_SCU
ESTOP_IN: SYS_CNTRL_UNIT.A29 SYS_CNTRL_UNIT.A30 ; off-sheet ESTOP_IN
LED_GND: SYS_CNTRL_UNIT.A23 ; off-sheet LED_GND
LED_MOSI: SYS_CNTRL_UNIT.A21 ; off-sheet LED_MOSI
LED_PWR: SYS_CNTRL_UNIT.A20 ; off-sheet LED_PWR
LED_SCLK: SYS_CNTRL_UNIT.A22 ; off-sheet LED_SCLK
LINK_LED_SCU: SYS_CNTRL_UNIT.B16 ; off-sheet LINK_LED_SCU
RCT_SCU: SYS_CNTRL_UNIT.B14 ; off-sheet RCT_SCU
RD+_SCU: SYS_CNTRL_UNIT.A16 ; off-sheet RD+_SCU
RD-_SCU: SYS_CNTRL_UNIT.A17 ; off-sheet RD-_SCU
RF_RELAY_IN: SYS_CNTRL_UNIT.A27 ; off-sheet RF_RELAY_IN
SCU_OVERRIDE_BTN: SYS_CNTRL_UNIT.B24 ; off-sheet SCU_OVERRIDE_BTN
SCU_OVERRIDE_PWR: SYS_CNTRL_UNIT.B23 ; off-sheet SCU_OVERRIDE_PWR
SCU_RESET_BTN: SYS_CNTRL_UNIT.B21 ; off-sheet SCU_RESET_BTN
SCU_RESET_PWR: SYS_CNTRL_UNIT.B20 ; off-sheet SCU_RESET_PWR
SCU_SYSMODE_AUTO: SYS_CNTRL_UNIT.B27 ; off-sheet SCU_SYSMODE_AUTO
SCU_SYSMODE_MNL: SYS_CNTRL_UNIT.B28 ; off-sheet SCU_SYSMODE_MNL
SCU_SYSMODE_PWR: SYS_CNTRL_UNIT.B26 ; off-sheet SCU_SYSMODE_PWR
SCU_SYSTEMON_BTN: SYS_CNTRL_UNIT.B31 ; off-sheet SCU_SYSTEMON_BTN
SCU_SYSTEMON_PWR: SYS_CNTRL_UNIT.B30 ; off-sheet SCU_SYSTEMON_PWR
TCT_SCU: SYS_CNTRL_UNIT.B13 ; off-sheet TCT_SCU
TD+_SCU: SYS_CNTRL_UNIT.A13 ; off-sheet TD+_SCU
TD-_SCU: SYS_CNTRL_UNIT.A14 ; off-sheet TD-_SCU

Not connected (* = marked no-connect by the designer): SYS_CNTRL_UNIT A11* A12* B11* B12*

### Notes on the sheet
- (near SYS_CNTRL_UNIT) SYSTEM CONTROL UNIT (SCU)
- ESP32 Development Board | CONN
- PAGE 1 / 1
- 7
- Rev 1.0
- D. Gusev

### Library data of the parts
SYS_CNTRL_UNIT = PCIeX16 female header: 164-position SAMTEC female header